# EAGLE design NMX-200 (EAGLE 7.6.0)
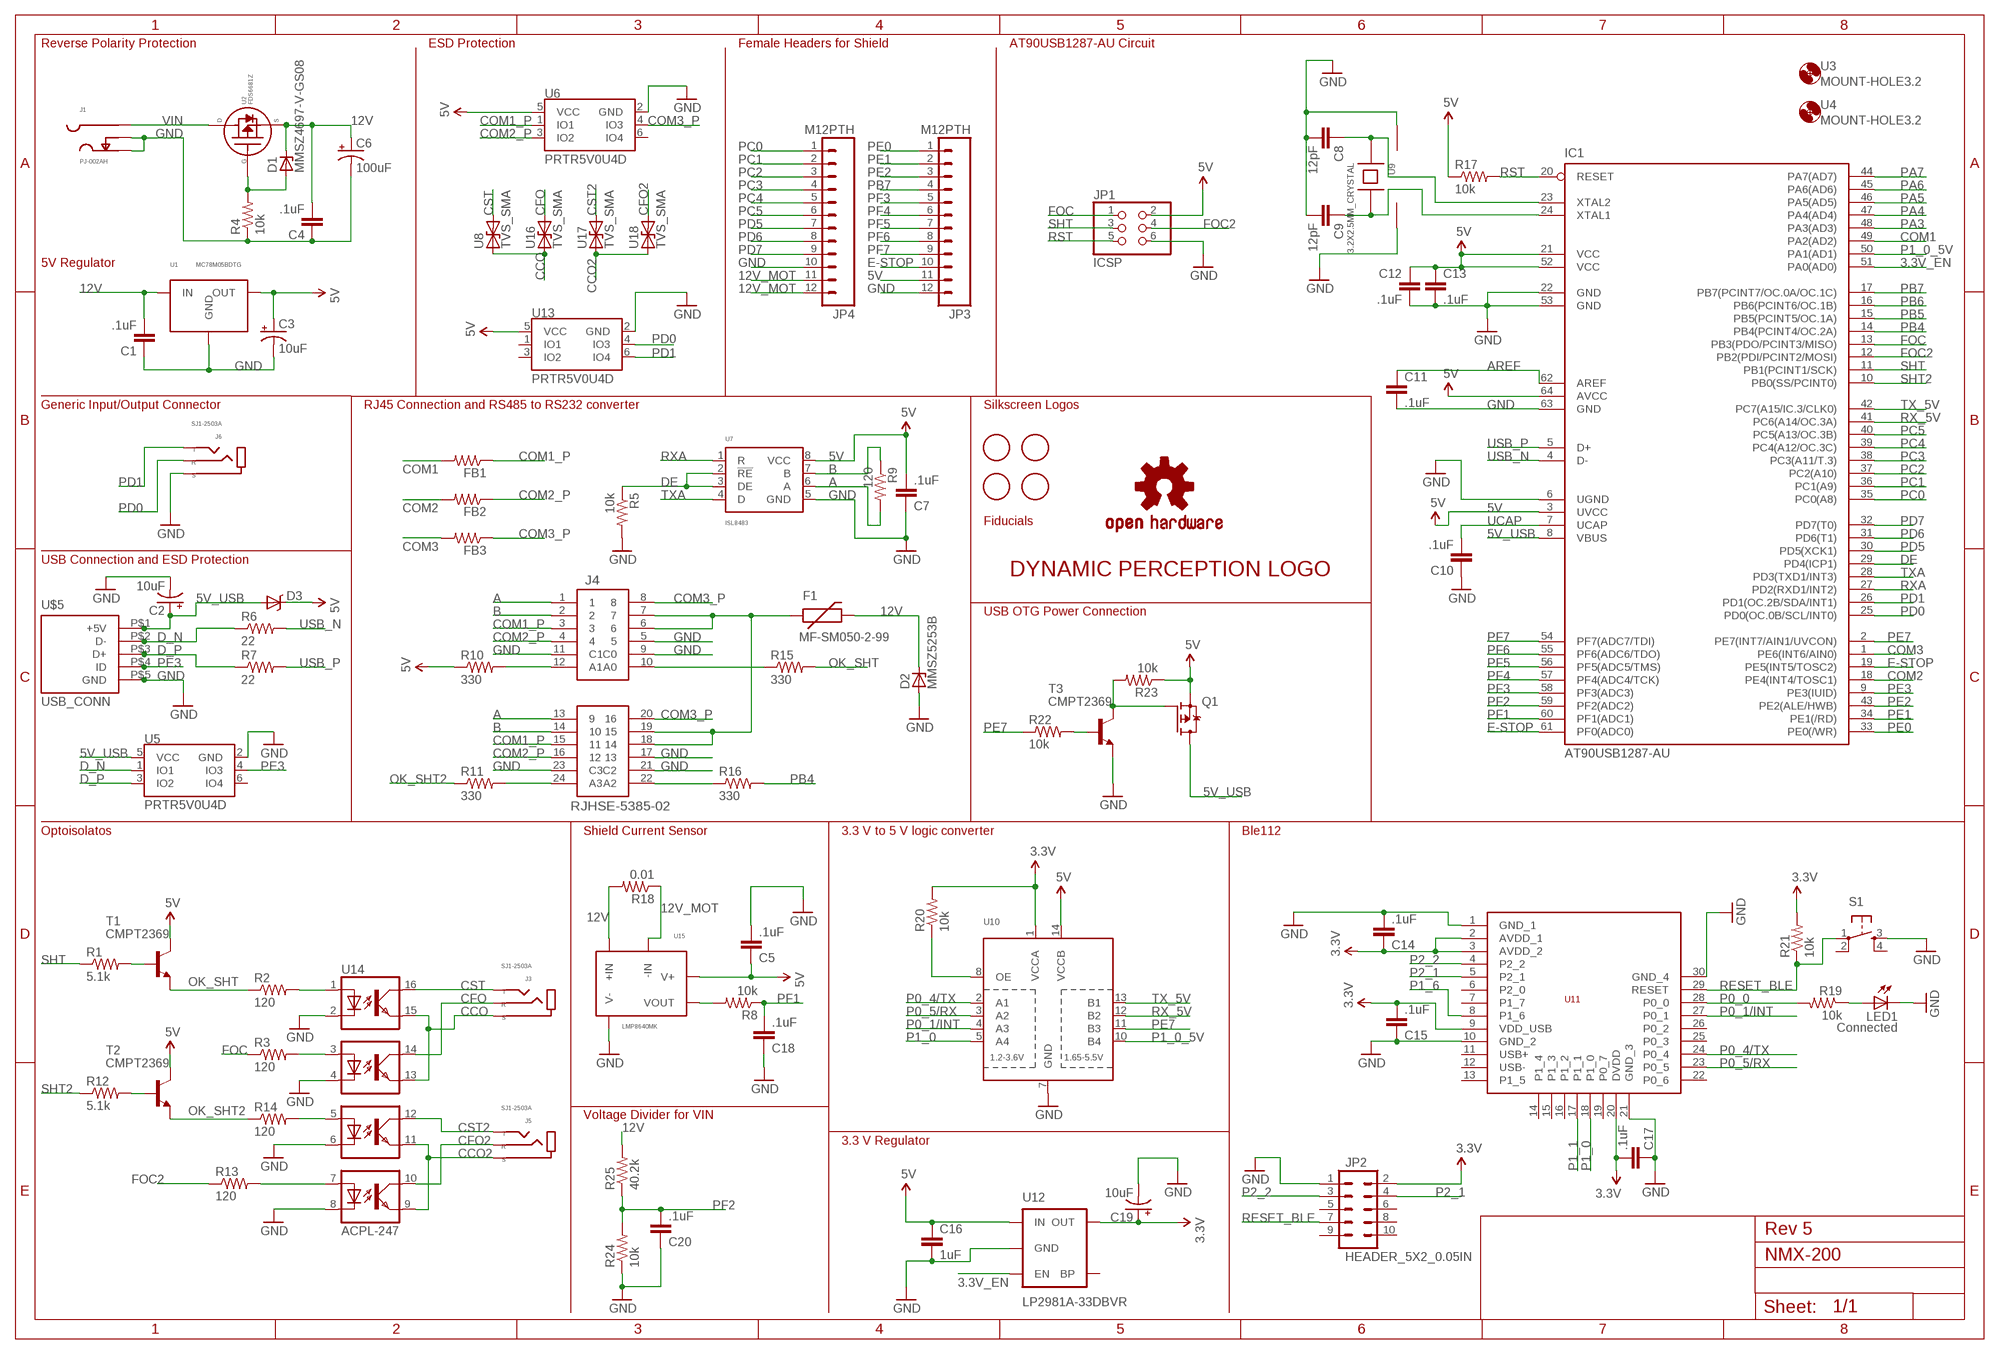
[diagram p0: schematic, sheet 1]

## Parts
C1  .1uF  CAP0402-CAP  [0402-CAP]
C2  10uF  CAP_POL1206  [EIA3216]
C3  10uF  CAP_POL1206  [EIA3216]
C4  .1uF  CAP0402-CAP  [0402-CAP]
C5  .1uF  CAP0402-CAP  [0402-CAP]
C6  100uF  CAP_POLD  [PANASONIC_D]
C7  .1uF  CAP0402-CAP  [0402-CAP]
C8  12pF  CAP0402-CAP  [0402-CAP]
C9  12pF  CAP0402-CAP  [0402-CAP]
C10  .1uF  CAP0402-CAP  [0402-CAP]
C11  .1uF  CAP0402-CAP  [0402-CAP]
C12  .1uF  CAP0402-CAP  [0402-CAP]
C13  .1uF  CAP0402-CAP  [0402-CAP]
C14  .1uF  CAP0402-CAP  [0402-CAP]
C15  .1uF  CAP0402-CAP  [0402-CAP]
C16  1uF  CAP0402-CAP  [0402-CAP]
C17  .1uF  CAP0402-CAP  [0402-CAP]
C18  .1uF  CAP0402-CAP  [0402-CAP]
C19  10uF  CAP_POL1206  [EIA3216]
C20  .1uF  CAP0402-CAP  [0402-CAP]
D1  MMSZ4697-V-GS08  ZENER-DIODESOD123  [SOD123]
D2  MMSZ5253B  ZENER-DIODESOD123  [SOD123]
D3  DIODE-SCHOTTKY-BAT20J  [SOD-323]
F1  MF-SM050-2-99  PTC2920  [PTC-2920]
FB1  HZ0402B102R-10  R-US_R0402  [R0402]
FB2  HZ0402B102R-10  R-US_R0402  [R0402]
FB3  HZ0402B102R-10  R-US_R0402  [R0402]
FRAME2  A3L-LOCSILK_SCREEN  [DRAWING_NAME]
IC1  AT90USB1287-AU  [TQFP64]
J1  PJ-002AH  DC_JACK  [DC_JACK_KLDX]
J3  SJ1-2503A  TRS_JACKSJ1-2503A  [SJ1-2503A]
J4  RJHSE-5385-02  RJ45_DOUBLEPTH  [RJHSE-5385-02]
J5  SJ1-2503A  TRS_JACKSJ1-2503A  [SJ1-2503A]
J6  SJ1-2503A  TRS_JACKSJ1-2503A  [SJ1-2503A]
JP1  ICSP  PINHD-2X3  [2X03]
JP2  HEADER_5X2_0.05IN  [HEADER_5X2_0.05IN]
JP3  M12PTH  [1X12]
JP4  M12PTH  [1X12]
LED1  Connected  LED0603  [LED-0603]
Q1  P-CHANNEL_MOSFET  [SOT23-3]
R1  5.1k  R-US_R0402  [R0402]
R2  120  R-US_R0402  [R0402]
R3  120  R-US_R0402  [R0402]
R4  10k  R-US_R0402  [R0402]
R5  10k  R-US_R0402  [R0402]
R6  22  R-US_R0402  [R0402]
R7  22  R-US_R0402  [R0402]
R8  10k  R-US_R0402  [R0402]
R9  120  R-US_R0402  [R0402]
R10  330  R-US_R0402  [R0402]
R11  330  R-US_R0402  [R0402]
R12  5.1k  R-US_R0402  [R0402]
R13  120  R-US_R0402  [R0402]
R14  120  R-US_R0402  [R0402]
R15  330  R-US_R0402  [R0402]
R16  330  R-US_R0402  [R0402]
R17  10k  R-US_R0402  [R0402]
R18  0.01  R-US_R1206  [R1206]
R19  10k  R-US_R0402  [R0402]
R20  10k  R-US_R0402  [R0402]
R21  10k  R-US_R0402  [R0402]
R22  10k  R-US_R0402  [R0402]
R23  10k  R-US_R0402  [R0402]
R24  10k  R-US_R0402  [R0402]
R25  40.2k  R-US_R0402  [R0402]
S1  TAC_SWITCH  [TACTICLE_SWITCH_SMD_EVQP0_BOT]
T1  CMPT2369  BCW60-NPN-SOT23-BEC  [SOT23-BEC]
T2  CMPT2369  BCW60-NPN-SOT23-BEC  [SOT23-BEC]
T3  CMPT2369  BCW60-NPN-SOT23-BEC  [SOT23-BEC]
U1  MC78M05BDTG  VOLTAGE_REG  [DPAK-3]
U2  FDS6681Z  MOSFET_P-CHANNEL  [DSO-8]
U3  MOUNT-HOLE3.2  [3,2]
U4  MOUNT-HOLE3.2  [3,2]
U5  PRTR5V0U4D  [SOT23-6]
U6  PRTR5V0U4D  [SOT23-6]
U7  ISL8483  SN65176D  [SO-08]
U8  TVS_SMA  [SMA_DIODE]
U9  3.2X2.5MM_CRYSTAL  [3.2X2.5MM]
U10  TXB0104PWR  [TSSOP14]
U11  BLE112  [BLE112-A]
U12  LP2981A-33DBVR  V_REG_LDOSMD  [SOT23-5]
U13  PRTR5V0U4D  [SOT23-6]
U14  ACPL-247  [16-SOIC]
U15  LMP8640MK  [6-SOT]
U16  TVS_SMA  [SMA_DIODE]
U17  TVS_SMA  [SMA_DIODE]
U18  TVS_SMA  [SMA_DIODE]
U$1  DP_LOGOMICRO  [DP_LOGO_MICRO]
U$2  OSHW-LOGOS  [OSHW-LOGO-S]
U$3  FIDUCIAL  [FIDUCIAL_1MM]
U$4  FIDUCIAL  [FIDUCIAL_1MM]
U$5  USB_CONN  [10118194-0001LF]
U$6  FIDUCIAL  [FIDUCIAL_1MM]
U$7  FIDUCIAL  [FIDUCIAL_1MM]

## Nets
3.3V: C14.1 C15.2 C17.2 C19.A(+) JP2.2 R20.2 R21.2 U10.1(VCCA) U11.2(AVDD_1) U11.3(AVDD_2) U11.9(VDD_USB) U11.20(DVDD) U12.5(OUT)
3.3V_EN: IC1.51(PA0(AD0)) U12.3(EN)
5V [vccControllers]: C3.A(+) C5.1 C7.2 C12.1 C13.1 C16.1 D3.C IC1.3(UVCC) IC1.21(VCC) IC1.52(VCC) IC1.64(AVCC) JP1.2 JP3.11 Q1.S R10.1 R17.1 R23.1 T1.C T2.C U1.2(OUT) U6.5(VCC) U7.8(VCC) U10.14(VCCB) U12.1(IN) U13.5(VCC) U15.6(V+)
5V_USB [vccControllers]: C2.A(+) D3.A IC1.8(VBUS) Q1.D U5.5(VCC) U$5.P$1(+5V)
12V [vccControllers]: C1.2 C4.2 C6.+ D1.C D2.C F1.P$2 R18.2 R25.2 U1.1(IN) U2.1(SOURCE) U2.2(SOURCE) U2.3(SOURCE) U15.3(+IN)
12V_MOT [vccControllers]: JP4.11 JP4.12 R18.1 U15.4(-IN)
A: J4.1 J4.13 R9.2 U7.6(A)
AREF: C11.1 IC1.62(AREF)
B: J4.2 J4.14 R9.1 U7.7(B)
CCO: J3.1(S) U8.C U14.13 U14.15 U16.C
CCO2: J5.1(S) U14.9 U14.11 U17.C U18.C
CFO: J3.4(R) U14.14 U16.A
CFO2: J5.4(R) U14.10 U18.A
COM1: FB1.2 IC1.49(PA2(AD2))
COM1_P: FB1.1 J4.3 J4.15 U6.1(IO1)
COM2: FB2.2 IC1.18(PE4(INT4/TOSC1))
COM2_P: FB2.1 J4.4 J4.16 U6.3(IO2)
COM3: FB3.2 IC1.1(PE6(INT6/AIN0))
COM3_P: FB3.1 J4.8 J4.20 U6.4(IO3)
CST: J3.2(T) J3.3(T) U8.A U14.16
CST2: J5.2(T) J5.3(T) U14.12 U17.A
D_N: R6.1 U5.1(IO1) U$5.P$2(D-)
D_P: R7.1 U5.3(IO2) U$5.P$3(D+)
DE: IC1.29(PD4(ICP1)) R5.1 U7.2(!RE) U7.3(DE)
E-STOP: IC1.19(PE5(INT5/TOSC2)) IC1.61(PF0(ADC0)) JP3.10
FOC: IC1.13(PB3(PDO/PCINT3/MISO)) JP1.1 R3.1
FOC2: IC1.12(PB2(PDI/PCINT2/MOSI)) JP1.4 R13.1
GND [gnd]: C1.1 C2.C(-) C3.C(-) C4.1 C5.2 C6.- C7.1 C8.2 C9.2 C10.1 C11.2 C12.2 C13.2 C14.2 C15.1 C16.2 C17.1 C18.1 C19.C(-) C20.1 D2.A IC1.6(UGND) IC1.22(GND) IC1.53(GND) IC1.63(GND) J1.GND(SLEEVE) J1.GNDBREAK(SLEEVE_SHUNT) J4.5 J4.9(C0) J4.11(C1) J4.17 J4.21(C2) J4.23(C3) J6.1(S) JP1.6 JP2.1 JP3.12 JP4.10 LED1.C R4.1 R5.2 R24.1 S1.3 T3.E U1.4(GND) U5.2(GND) U6.2(GND) U7.5(GND) U9.2(GND) U9.4 U10.7(GND) U11.1(GND_1) U11.10(GND_2) U11.21(GND_3) U11.30(GND_4) U12.2(GND) U13.2(GND) U14.2 U14.4 U14.6 U14.8 U15.2(V-) U$5.P$5(GND)
N$1: R20.1 U10.8(OE)
N$2: R22.2 T3.B
N$3: LED1.A R19.1
N$4: J4.10(A0) R15.1
N$5: D1.A R4.2 U2.4(GATE)
N$6: R2.2 U14.1
N$7: R3.2 U14.3
N$8: R8.2 U15.1(VOUT)
N$9: R14.2 U14.5
N$10: R13.2 U14.7
N$11: J4.12(A1) R10.2
N$12: J4.24(A3) R11.2
N$13: Q1.G R23.2 T3.C
N$14: J4.22(A2) R16.1
N$15 [vcc]: F1.P$1 J4.6 J4.7 J4.18 J4.19
N$17: R1.2 T1.B
N$67: R12.2 T2.B
OK_SHT: R2.1 R15.2 T1.E
OK_SHT2: R11.1 R14.1 T2.E
P0_0: R19.2 U11.28(P0_0)
P0_1/INT: U10.4(A3) U11.27(P0_1)
P0_4/TX: U10.2(A1) U11.24(P0_4)
P0_5/RX: U10.3(A2) U11.23(P0_5)
P1_0: U10.5(A4) U11.18(P1_0)
P1_0_5V: IC1.50(PA1(AD1)) U10.10(B4)
P1_1: U11.17(P1_1)
P1_6: U11.8(P1_6)
P2_1: JP2.4 U11.5(P2_1)
P2_2: JP2.3 U11.4(P2_2)
PA3: IC1.48(PA3(AD3))
PA4: IC1.47(PA4(AD4))
PA5: IC1.46(PA5(AD5))
PA6: IC1.45(PA6(AD6))
PA7: IC1.44(PA7(AD7))
PB4: IC1.14(PB4(PCINT4/OC.2A)) R16.2
PB5: IC1.15(PB5(PCINT5/OC.1A))
PB6: IC1.16(PB6(PCINT6/OC.1B))
PB7: IC1.17(PB7(PCINT7/OC.0A/OC.1C)) JP3.4
PC0: IC1.35(PC0(A8)) JP4.1
PC1: IC1.36(PC1(A9)) JP4.2
PC2: IC1.37(PC2(A10)) JP4.3
PC3: IC1.38(PC3(A11/T.3)) JP4.4
PC4: IC1.39(PC4(A12/OC.3C)) JP4.5
PC5: IC1.40(PC5(A13/OC.3B)) JP4.6
PD0: IC1.25(PD0(OC.0B/SCL/INT0)) J6.4(R) U13.4(IO3)
PD1: IC1.26(PD1(OC.2B/SDA/INT1)) J6.2(T) J6.3(T) U13.6(IO4)
PD5: IC1.30(PD5(XCK1)) JP4.7
PD6: IC1.31(PD6(T1)) JP4.8
PD7: IC1.32(PD7(T0)) JP4.9
PE0: IC1.33(PE0(/WR)) JP3.1
PE1: IC1.34(PE1(/RD)) JP3.2
PE2: IC1.43(PE2(ALE/HWB)) JP3.3
PE3: IC1.9(PE3(IUID)) U5.4(IO3) U$5.P$4(ID)
PE7: IC1.2(PE7(INT7/AIN1/UVCON)) R22.1 U10.11(B3)
PF1: C18.2 IC1.60(PF1(ADC1)) R8.1
PF2: C20.2 IC1.59(PF2(ADC2)) R24.2 R25.1
PF3: IC1.58(PF3(ADC3)) JP3.5
PF4: IC1.57(PF4(ADC4/TCK)) JP3.6
PF5: IC1.56(PF5(ADC5/TMS)) JP3.7
PF6: IC1.55(PF6(ADC6/TDO)) JP3.8
PF7: IC1.54(PF7(ADC7/TDI)) JP3.9
RESET_BLE: JP2.7 R21.1 S1.1 U11.29(RESET)
RST: IC1.20(RESET) JP1.5 R17.2
RX_5V: IC1.41(PC6(A14/OC.3A)) U10.12(B2)
RXA: IC1.27(PD2(RXD1/INT2)) U7.1(R)
SHT: IC1.11(PB1(PCINT1/SCK)) JP1.3 R1.1
SHT2: IC1.10(PB0(SS/PCINT0)) R12.1
TX_5V: IC1.42(PC7(A15/IC.3/CLK0)) U10.13(B1)
TXA: IC1.28(PD3(TXD1/INT3)) U7.4(D)
UCAP: C10.2 IC1.7(UCAP)
USB_N: IC1.4(D-) R6.2
USB_P: IC1.5(D+) R7.2
VIN [PowerInput]: J1.PWR(PIN) U2.5(DRAIN) U2.6(DRAIN) U2.7(DRAIN) U2.8(DRAIN)
XTAL1: C9.1 IC1.24(XTAL1) U9.3
XTAL2: C8.1 IC1.23(XTAL2) U9.1
Unconnected: JP2.5 JP2.6 JP2.8 JP2.9 JP2.10 S1.2 S1.4 U5.6(IO4) U6.6(IO4) U11.6(P2_0) U11.7(P1_7) U11.11(USB+) U11.12(USB-) U11.13(P1_5) U11.14(P1_4) U11.15(P1_3) U11.16(P1_2) U11.19(P0_7) U11.22(P0_6) U11.25(P0_3) U11.26(P0_2) U12.4(BP) U13.1(IO1) U13.3(IO2)

## Notes on the sheet
- Reverse Polarity Protection | ESD Protection | Female Headers for Shield | AT90USB1287-AU Circuit
- 5V Regulator
- Generic Input/Output Connector | RJ45 Connection and RS485 to RS232 converter | Silkscreen Logos
- Fiducials
- USB Connection and ESD Protection
- USB OTG Power Connection
- Optoisolatos | Shield Current Sensor | 3.3 V to 5 V logic converter | Ble112
- Voltage Divider for VIN
- 3.3 V Regulator
- Rev 5

## Library data of the parts
C1 C4 C5 C7 C10-C15 C17 C18 C20 = SparkFun-Capacitors:CAP: Capacitor Standard 0603 ceramic capacitor, and 0.1" leaded capacitor.; MF: Taiyo Yuden; MPN: TMK105BJ104KV-F
C2 C3 C19 = SparkFun-Capacitors:CAP_POL: Capacitor Polarized These are standard SMD and PTH capacitors. Normally 10uF, 47uF, and 100uF in electrolytic and tantalum varieties. Always verify the external diameter of the through hole cap, it varies with capacity, voltage, and manufacturer. The EIA devices should be standard.; MF: Kemet; MPN: T491A106M016AT
C6 = SparkFun-Capacitors:CAP_POL: Capacitor Polarized These are standard SMD and PTH capacitors. Normally 10uF, 47uF, and 100uF in electrolytic and tantalum varieties. Always verify the external diameter of the through hole cap, it varies with capacity, voltage, and manufacturer. The EIA devices should be standard.; MF: Panasonic Electronic Components; MPN: EEE-1EA101XP
C8 C9 = SparkFun-Capacitors:CAP: Capacitor Standard 0603 ceramic capacitor, and 0.1" leaded capacitor.; MF: TDK Corporation; MPN: C1005C0G1H120J050BA
C16 = SparkFun-Capacitors:CAP: Capacitor Standard 0603 ceramic capacitor, and 0.1" leaded capacitor.; MF: TDK Corporation; MPN: C1005X5R1C105K050BC
D1 = diode:ZENER-DIODE: Z-Diode; MF: Vishay Semiconductor Diodes Division; MPN: MMSZ4697-E3-08
D2 = diode:ZENER-DIODE: Z-Diode; MF: Fairchild Semiconductor; MPN: MMSZ5253B
D3 = SparkFun-DiscreteSemi:DIODE-SCHOTTKY: Schottky diodes in SFE's production catalog BAT20J 1A 23V 0.62Vf RB751 120mA 40V 0.37Vf PMEG4005EJ 0.5A 40V 0.42Vf MBRA140 1A 40V 0.5Vf B340A 3A 40V SMA; MF: NXP Semiconductors; MPN: PMEG3010BEA,115; PROD_ID: DIO-11623; VALUE: BAT20J
F1 = SparkFun-PowerIC:PTC: Resettable Fuse PTC Resettable Fuse. Spark Fun Electronics SKU : COM-08357; MF: Bel Fuse; MPN: 0ZCD0050FF2C
FB1-FB3 = resistor:R-US_: RESISTOR, American symbol; MF: Laird-Signal Integrity Products; MPN: HZ0402B102R-10
FRAME2 = frames:A3L-LOC: FRAME DIN A3, landscape with location and doc. field
IC1 = at90usb:AT90USB1287-*: Atmel AT90USB1287 AVR Microcontroller with USB Interface and 128kB Flash Memory; MF: Atmel; MPN: AT90USB1287-AU
J1 = QS_Components:DC_JACK; MF: CUI Inc; MPN: PJ-002AH
J3 J5 J6 = PP_Connectors:TRS_JACK: TRS Jacks; MF: CUI Inc; MPN: SJ1-2503A
J4 = PP_Connectors:RJ45_DOUBLE: RJ45 Connectors - Double; MF: Amphenol Commercial Products; MPN: RJHSE-5385-02
JP1 = pinhead:PINHD-2X3: PIN HEADER; MF: FCI; MPN: 67996-406HLF
JP2 = QS_Components:HEADER_5X2_0.05IN; MF: FCI; MPN: 20021121-00010T4LF
JP3 JP4 = SparkFun-Connectors:M12: Header 12 Standard 12-pin 0.1" header. Use with straight break away headers (SKU : PRT-00116), right angle break away headers (PRT-00553), swiss pins (PRT-00743), machine pins (PRT-00117), and female headers (PRT-00115).; MF: Sullins Connector Solutions; MPN: PPTC121LFBN-RC
LED1 = SparkFun-LED:LED: LEDs Standard schematic elements and footprints for 5mm, 3mm, 1206, and 0603 sized LEDs. 5mm - Spark Fun Electronics SKU : COM-00529 (and others); MF: Lite-On Inc; MPN: LTST-S270TBKT
Q1 = QS_Components:P-CHANNEL_MOSFET; MF: Fairchild Semiconductor; MPN: FDV304P
R1 R12 = resistor:R-US_: RESISTOR, American symbol; MF: Yageo; MPN: RC0402JR-075K1L
R2 R3 R13 R14 = resistor:R-US_: RESISTOR, American symbol; MF: Yageo; MPN: RC0402FR-07180RL
R4 R5 R8 R17 R20-R24 = resistor:R-US_: RESISTOR, American symbol; MF: Yageo; MPN: RC0402FR-0710KL
R6 R7 = resistor:R-US_: RESISTOR, American symbol; MF: Yageo; MPN: RC0402JR-0722RL
R9 = resistor:R-US_: RESISTOR, American symbol; MF: Yageo; MPN: RC0402JR-07120RL
R10 R11 R15 R16 = resistor:R-US_: RESISTOR, American symbol; MF: Yageo; MPN: RC0402FR-07330RL
R18 = resistor:R-US_: RESISTOR, American symbol; MF: TE Connectivity; MPN: RLP73V2BR010JTD
R19 = resistor:R-US_: RESISTOR, American symbol; MF: Yageo; MPN: RC0402FR-0714KL
R25 = resistor:R-US_: RESISTOR, American symbol; MF: Yageo; MPN: RC0402FR-0740K2L
S1 = SparkFun-Electromechanical:TAC_SWITCH: Momentary Switch Button commonly used for reset or general input. Spark Fun Electronics SKU : COM-00097 SMT- SWCH-08247; MF: Panasonic Electronic Components; MPN: EVQ-P0Q02Q
T1 T2 = transistor:*-NPN-: NPN Transistror BF959 corrected 2008.03.06; MF: Rohm Semiconductor; MPN: 2SD1757KT146Q
T3 = transistor:*-NPN-: NPN Transistror BF959 corrected 2008.03.06; MF: Fairchild Semiconductor; MPN: BC847BMTF
U1 = QS_Components:VOLTAGE_REG; MF: ON Semiconductor; MPN: MC78M05BDTRKG
U2 = QS_Components:MOSFET_P-CHANNEL; MF: Fairchild Semiconductor; MPN: FDS6681Z
U3 U4 = holes:MOUNT-HOLE: MOUNTING HOLE with drill center marker
U5 U6 U13 = QS_Components:PRTR5V0U4D; MF: NXP Semiconductors; MPN: PRTR5V0U4D
U7 = texas:SN65176: DIFFERENTIAL BUS TRANSCEIVER Source: http://focus.ti.com .. sn65176b.pdf; MF: TEXAS INSTRUMENTS; MPN: SN65176BD; OC_FARNELL: 9589970; OC_NEWARK: 08F5891
U8 U16-U18 = QS_Components:TVS_SMA; MF: Bourns Inc; MPN: SMAJ48CA
U9 = QS_Components:3.2X2.5MM_CRYSTAL; MF: AVX Corp/Kyocera Corp; MPN: CX3225SB16000E0FPZ25
U10 = SparkFun-DigitalIC:TXB0104PWR: 4-Bit Bi-Directional Level Shifter 1.2V-3.6V (VCCA) to 1.65V-5.5V (VCCB) bi-directional level shifter with auto direction sensing. Max data rate - VCCA 1.8V: 20Mbps (50ns), VCCA 3.3V: 100Mbps (10ns) Digikey: 296-21929-1-ND (TSSOP) IC-11329; MF: Texas Instruments; MPN: TXB0104PWR
U11 = Bluegiga:BLE112: Bluetooth low energy single mode module is a single mode device targeted for low power sensors and accessories.; MF: BlueGiga Technologies Inc; MPN: BLE112-A-V1
U12 = SparkFun-PowerIC:V_REG_LDO: Voltage Regulator LDO Standard 150mA LDO voltage regulator in SOT-23 layout. Micrel part MIC5205. BP (by-pass) pin is used to lower output noise with 470pF cap.; MF: Texas Instruments; MPN: LP2981A-33DBVR
U14 = QS_Components:ACPL-247; MF: Avago Technologies US Inc.; MPN: ACPL-247-500E
U15 = QS_Components:LMP8640MK; MF: Texas Instruments; MPN: LMP8640MK-H/NOPB
U$1 = QS_Components:DP_LOGO
U$2 = SparkFun-Aesthetics:OSHW-LOGO: Open Source Hardware Logo This logo indicates the piece of hardware it is found on incorporates a OSHW license and/or adheres to the definition of open source hardware found here: http://freedomdefined.org/OSHW
U$3 U$4 U$6 U$7 = adafruit:FIDUCIAL: For use by pick and place machines to calibrate the vision/machine, 1mm By microbuilder.eu
U$5 = dynamic_perception:USB_CONN

## Net classes
0 default: width 0.203 mm, drill 0.254 mm, clearance 0.152 mm
1 vcc: width 0.61 mm, drill 0.254 mm, clearance 0.152 mm
2 gnd: width 0.305 mm, drill 0.254 mm, clearance 0.152 mm
3 vccControllers: width 0.305 mm, drill 0.254 mm, clearance 0.152 mm
4 StepperPower: width 0.635 mm, drill 0.254 mm, clearance 0.152 mm
5 PowerInput: width 1.27 mm, clearance 0.152 mm

## Board
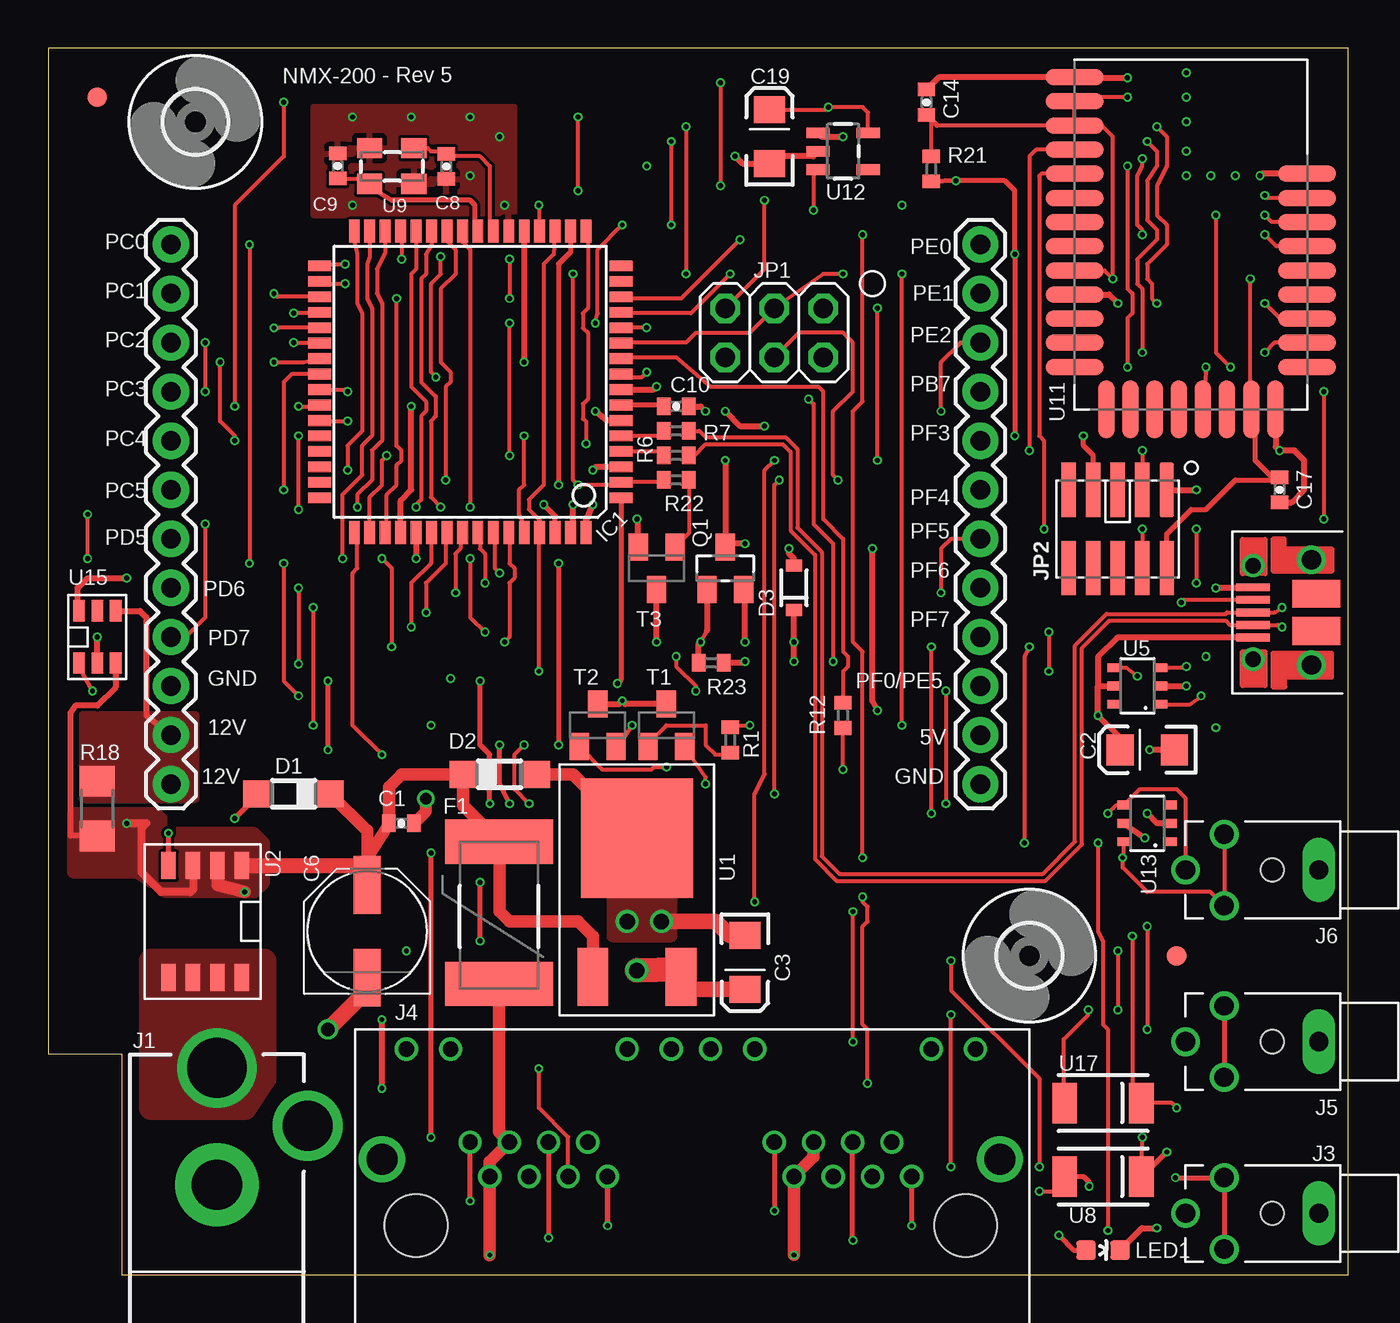
[diagram p1: board, top side]
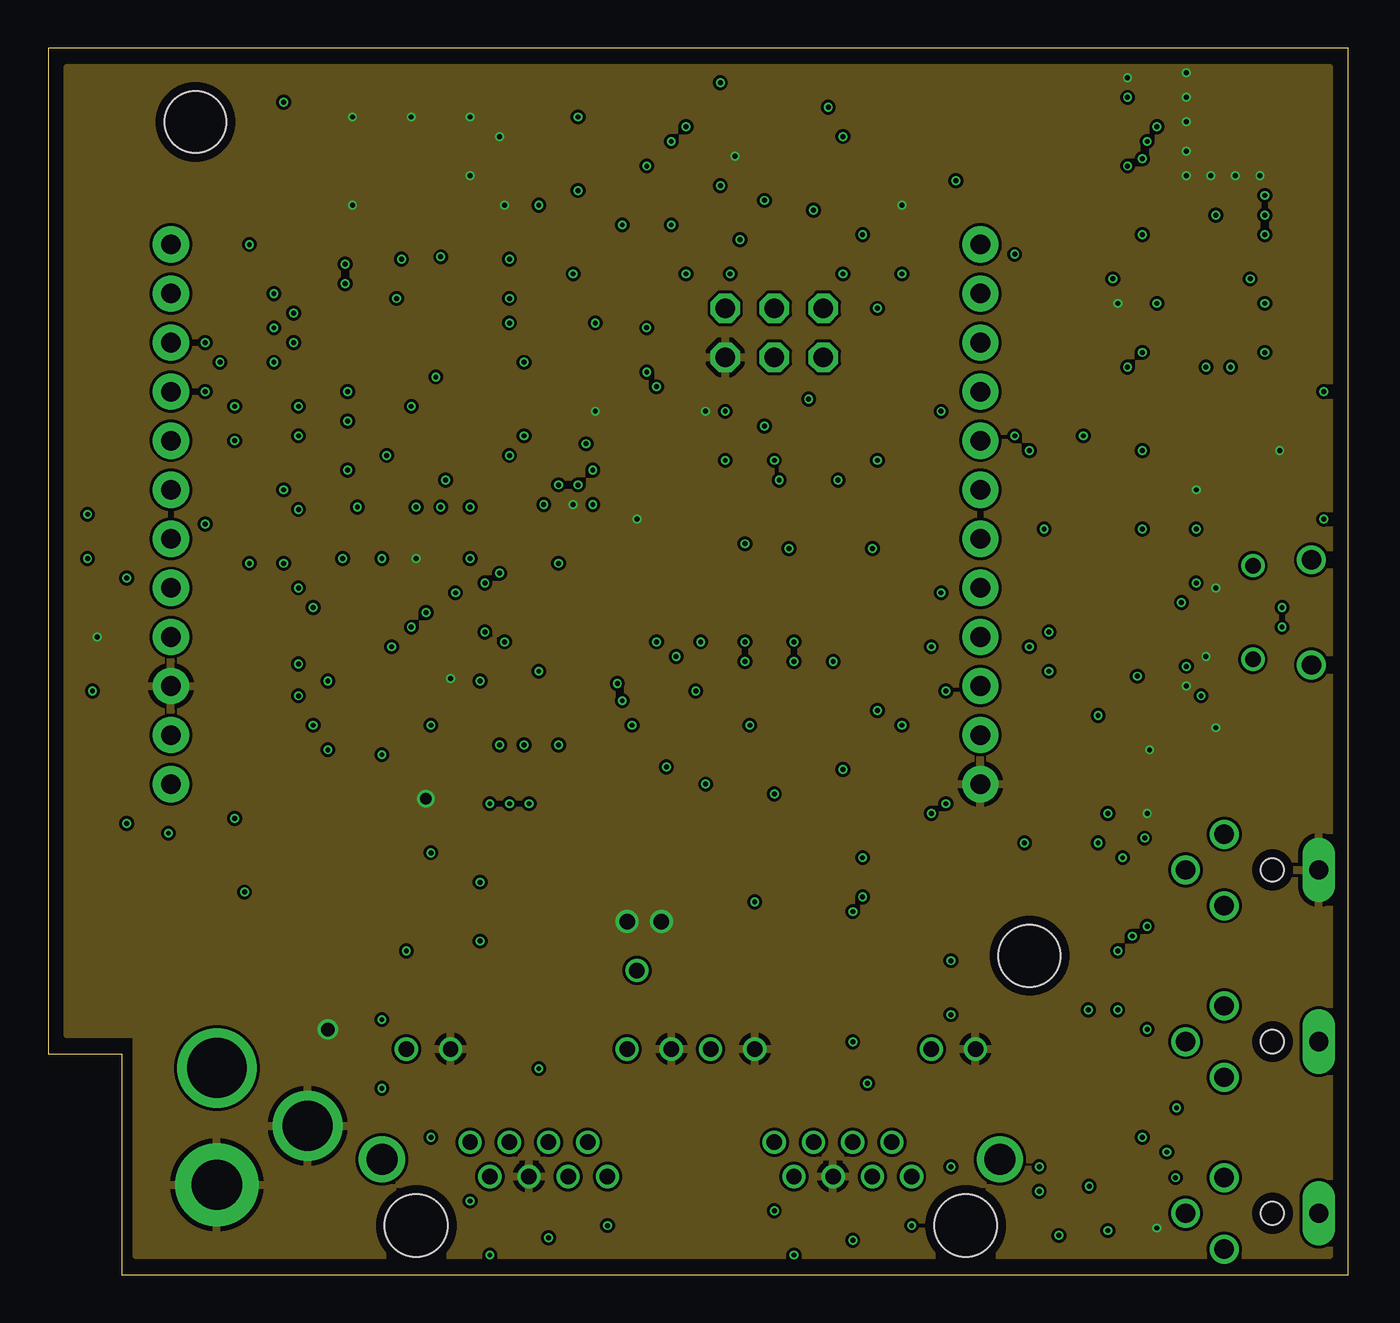
[diagram p2: board, inner layer Route2]
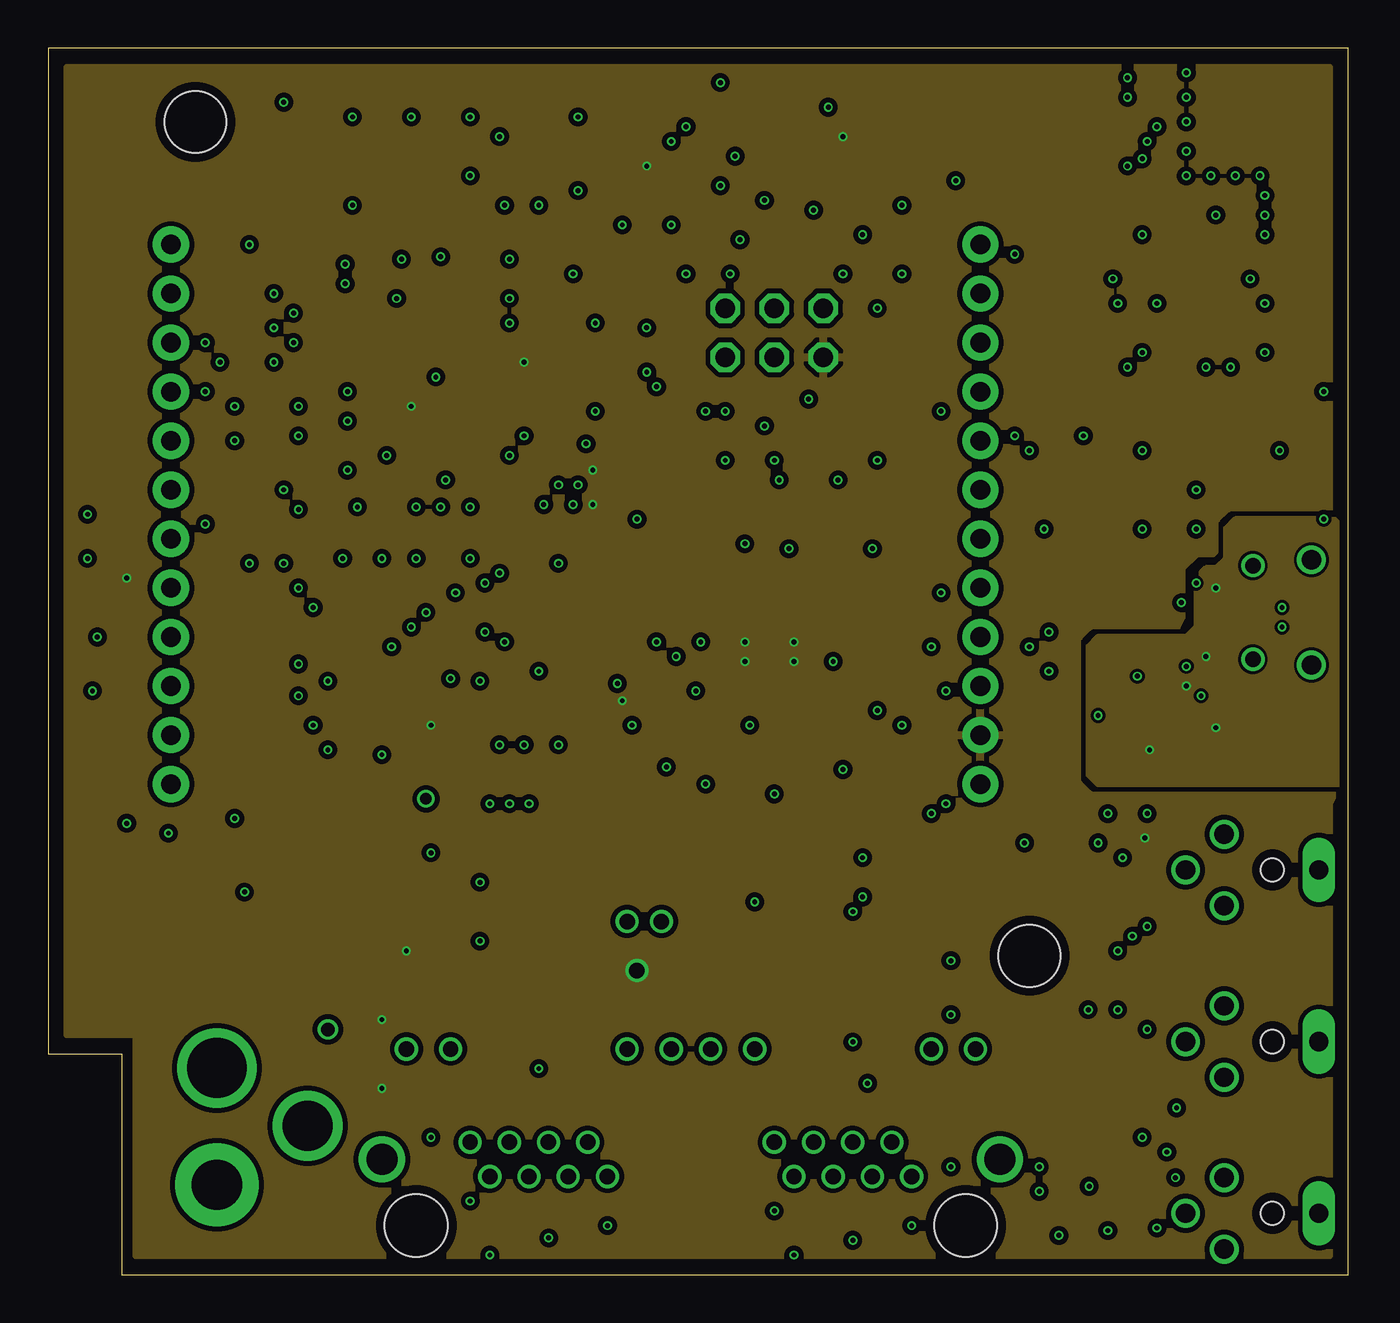
[diagram p3: board, inner layer Route15]
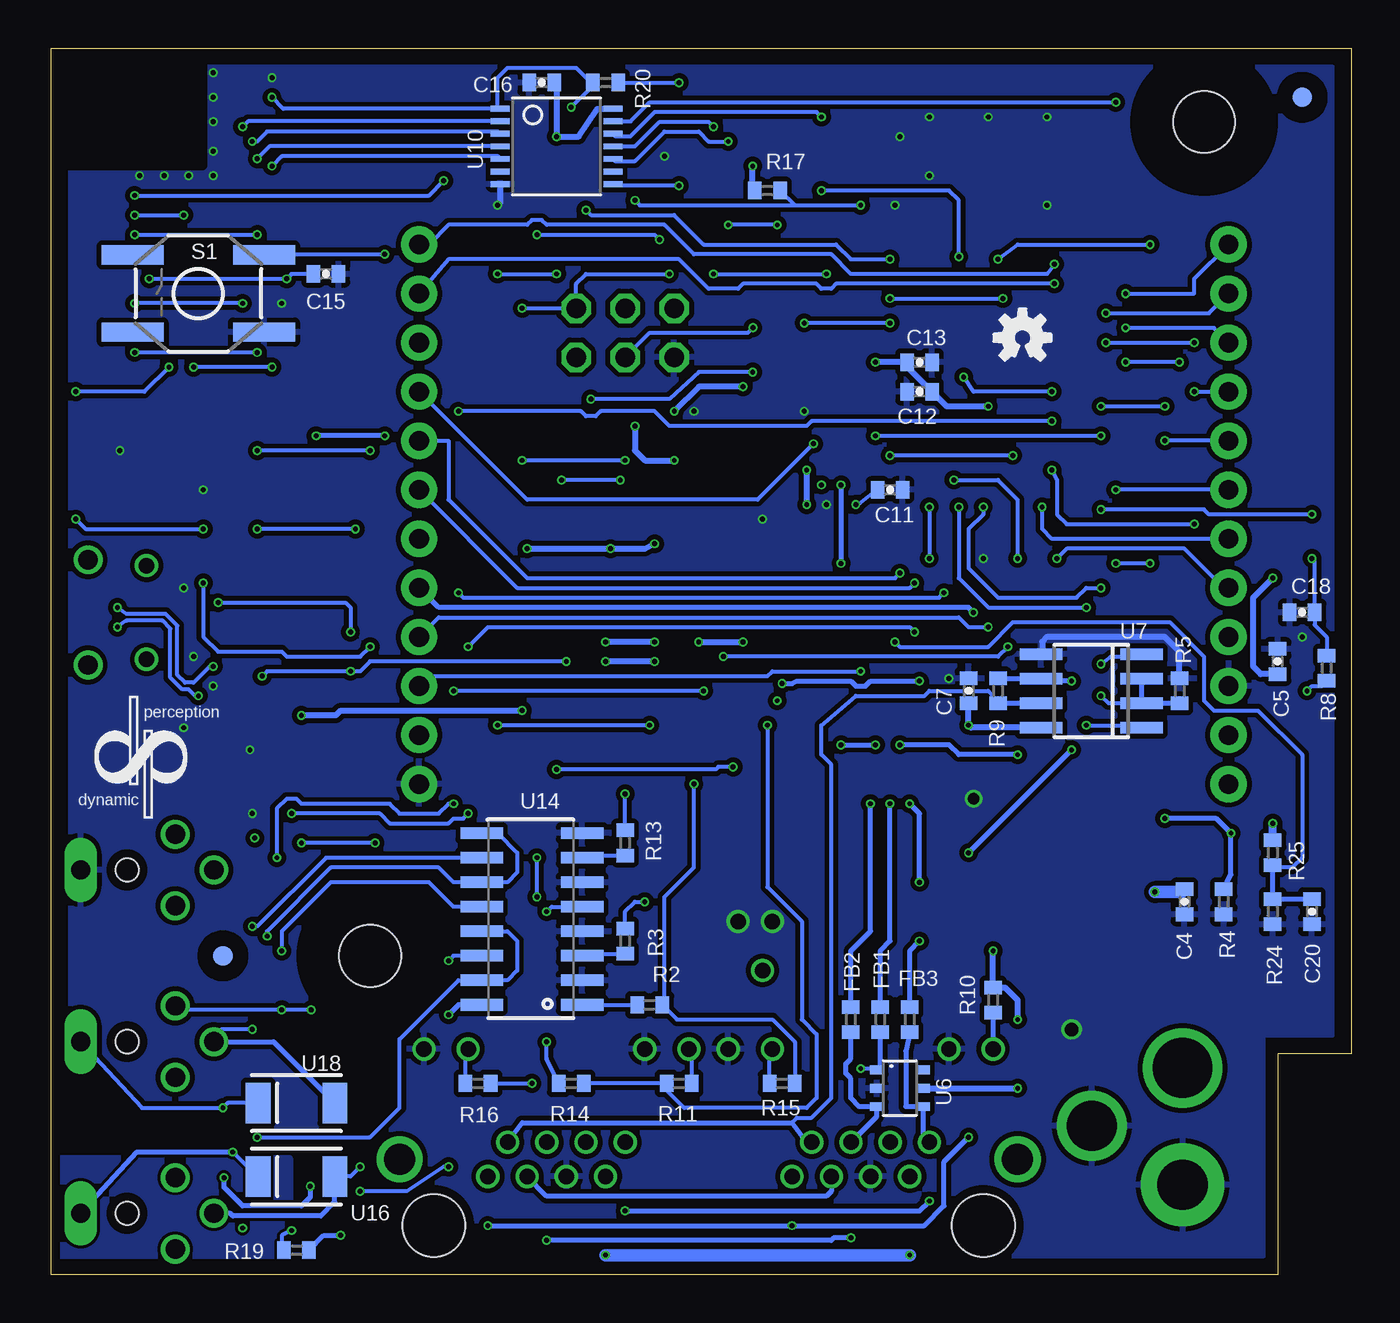
[diagram p4: board, bottom side, seen from below]

Size 67.31 x 63.5 mm. Coordinates in mm from the lower left corner, seen from the top.
Outline: 67.31,0 67.31,63.5 0,63.5 0,11.43 3.81,11.43 3.81,0 67.31,0
Copper layers (1*2*15*16): Top 0.035559375mm / dielectric 0.17018125mm / Route2 0.01778125mm / dielectric 47mil / Route15 0.01778125mm / dielectric 0.17018125mm / Bottom 0.035559375mm
Design rules "OSHPark-4layer *": minimum track width 5mil, minimum drill 10mil, track to track 5mil, track to pad 5mil, pad to pad 5mil, via to via 5mil, smd to smd 5mil, copper to edge 18mil, drill to drill 6mil, minimum pad ring 4mil, minimum via ring 4mil, stop-mask expansion 2.5mil, vias tented up to drill 11mil, thermal gap 10mil

### Footprints (pad centres in the part's own frame; a part is rotated, then mirrored left to right if it is on the bottom)
0402-CAP = smd 0.7 x 0.9: 1 -0.65,0; 2 0.65,0
EIA3216 = smd 1.4 x 1.6: A -1.4,0; C 1.4,0
PANASONIC_D = smd 3 x 1.4: + -2.4,0; - 2.4,0
SOD123 = smd 1.4 x 1.4: A 1.9,0; C -1.9,0
SOD-323 = smd 0.63 x 0.83: A 1.15,0; C -1.15,0
PTC-2920 = smd 2.286 x 5.588: P$1 -3.683,0; P$2 3.683,0
R0402 = smd 0.7 x 0.9: 1 -0.65,0; 2 0.65,0
TQFP64 = smd 1.194 x 0.559: 1 -7.8,6; 2 -7.8,5.2; 3 -7.8,4.4; 4 -7.8,3.6; 5 -7.8,2.8; 6 -7.8,2; 7 -7.8,1.2; 8 -7.8,0.4; 9 -7.8,-0.4; 10 -7.8,-1.2; 11 -7.8,-2; 12 -7.8,-2.8; 13 -7.8,-3.6; 14 -7.8,-4.4; 15 -7.8,-5.2; 16 -7.8,-6; 33 7.8,-6; 34 7.8,-5.2; 35 7.8,-4.4; 36 7.8,-3.6; 37 7.8,-2.8; 38 7.8,-2; 39 7.8,-1.2; 40 7.8,-0.4; 41 7.8,0.4; 42 7.8,1.2; 43 7.8,2; 44 7.8,2.8; 45 7.8,3.6; 46 7.8,4.4; 47 7.8,5.2; 48 7.8,6 | smd 0.559 x 1.194: 17 -6,-7.8; 18 -5.2,-7.8; 19 -4.4,-7.8; 20 -3.6,-7.8; 21 -2.8,-7.8; 22 -2,-7.8; 23 -1.2,-7.8; 24 -0.4,-7.8; 25 0.4,-7.8; 26 1.2,-7.8; 27 2,-7.8; 28 2.8,-7.8; 29 3.6,-7.8; 30 4.4,-7.8; 31 5.2,-7.8; 32 6,-7.8; 49 6,7.8; 50 5.2,7.8; 51 4.4,7.8; 52 3.6,7.8; 53 2.8,7.8; 54 2,7.8; 55 1.2,7.8; 56 0.4,7.8; 57 -0.4,7.8; 58 -1.2,7.8; 59 -2,7.8; 60 -2.8,7.8; 61 -3.6,7.8; 62 -4.4,7.8; 63 -5.2,7.8; 64 -6,7.8
DC_JACK_KLDX = drill 2.6 pad 4.318: GND 0,0.85 | drill 2.6: GNDBREAK 4.7,3.9 | drill 3.1: PWR 0,6.9
SJ1-2503A = drill 1 pad 1.676 long: 1 -2.54,0 | drill 1: 2 2.36,-1.85; 3 2.36,1.85; 4 4.36,0 | hole 1.2: -0.14,0
RJHSE-5385-02 = drill 0.8: 1 -4.07,1.27; 2 -5.09,3.05; 3 -6.1,1.27; 4 -7.12,3.05; 5 -8.13,1.27; 6 -9.15,3.05; 7 -10.16,1.27; 8 -11.18,3.05; 9 -0.76,7.87; 10 -3.05,7.87; 11 -12.19,7.87; 12 -14.48,7.87; 13 11.68,1.27; 14 10.66,3.05; 15 9.65,1.27; 16 8.63,3.05; 17 7.62,1.27; 18 6.6,3.05; 19 5.59,1.27; 20 4.57,3.05; 21 14.99,7.87; 22 12.7,7.87; 23 3.56,7.87; 24 1.27,7.87 | drill 1.6: P$1 -15.745,2.16; P$2 16.255,2.16 | hole 3.251: -13.97,-1.27; 14.48,-1.27
2X03 = drill 1.016 octagon: 1 -2.54,-1.27; 2 -2.54,1.27; 3 0,-1.27; 4 0,1.27; 5 2.54,-1.27; 6 2.54,1.27
HEADER_5X2_0.05IN = smd 2.8 x 0.74: 1 -2.03,2.54; 2 2.03,2.54; 3 -2.03,1.27; 4 2.03,1.27; 5 -2.03,0; 6 2.03,0; 7 -2.03,-1.27; 8 2.03,-1.27; 9 -2.03,-2.54; 10 2.03,-2.54
1X12 = drill 1.016 pad 1.88: 1 -13.97,0; 2 -11.43,0; 3 -8.89,0; 4 -6.35,0; 5 -3.81,0; 6 -1.27,0; 7 1.27,0; 8 3.81,0; 9 6.35,0; 10 8.89,0; 11 11.43,0; 12 13.97,0
LED-0603 = smd 1 x 1: A 0.877,0; C -0.877,0
SOT23-3 = smd 1.4 x 1: D 1.1,0; G -1.1,0.95; S -1.1,-0.95
R1206 = smd 1.6 x 1.803: 1 -1.422,0; 2 1.422,0
TACTICLE_SWITCH_SMD_EVQP0_BOT = smd 3.2 x 1 bottom: 1 -3.4,2; 2 3.4,2; 3 -3.4,-2; 4 3.4,-2
SOT23-BEC = smd 1 x 1.4: B -0.95,-1.1; C 0,1.1; E 0.95,-1.1
DPAK-3 = smd 3 x 1.6: 1 -4.39,2.285; 2 -4.39,-2.285 | smd 6.2 x 5.8: 4 2.79,0
DSO-8 = smd 1.4 x 0.75: 1 -2.9,1.905; 2 -2.9,0.635; 3 -2.9,-0.635; 4 -2.9,-1.905; 5 2.9,-1.905; 6 2.9,-0.635; 7 2.9,0.635; 8 2.9,1.905
3,2 = hole 3.2: 0,0
SOT23-6 = smd 0.7 x 0.45: 1 -1.2,0.95; 2 -1.2,0; 3 -1.2,-0.95; 4 1.2,-0.95; 5 1.2,0; 6 1.2,0.95
SO-08 = smd 2.2 x 0.6: 1 -2.6,1.905; 2 -2.6,0.635; 3 -2.6,-0.635; 4 -2.6,-1.905; 5 2.6,-1.905; 6 2.6,-0.635; 7 2.6,0.635; 8 2.6,1.905
SMA_DIODE = smd 1.27 x 2.1: A 1.985,0; C -1.985,0
3.2X2.5MM = smd 1.05 x 1.3: 1 -0.925,1.15; 2 -0.925,-1.15; 3 0.925,-1.15; 4 0.925,1.15
TSSOP14 = smd 0.991 x 0.305: 1 -2.918,1.95; 2 -2.918,1.3; 3 -2.918,0.65; 4 -2.918,0; 5 -2.918,-0.65; 6 -2.918,-1.3; 7 -2.918,-1.95; 8 2.918,-1.95; 9 2.918,-1.3; 10 2.918,-0.65; 11 2.918,0; 12 2.918,0.65; 13 2.918,1.3; 14 2.918,1.95
BLE112-A = smd 3 x 0.85: 1 -6.025,8.15; 2 -6.025,6.9; 3 -6.025,5.65; 4 -6.025,4.4; 5 -6.025,3.15; 6 -6.025,1.9; 7 -6.025,0.65; 8 -6.025,-0.6; 9 -6.025,-1.85; 10 -6.025,-3.1; 11 -6.025,-4.35; 12 -6.025,-5.6; 13 -6.025,-6.85; 22 6.025,-6.85; 23 6.025,-5.6; 24 6.025,-4.35; 25 6.025,-3.1; 26 6.025,-1.85; 27 6.025,-0.6; 28 6.025,0.65; 29 6.025,1.9; 30 6.025,3.15 | smd 0.85 x 3: 14 -4.375,-9.05; 15 -3.125,-9.05; 16 -1.875,-9.05; 17 -0.625,-9.05; 18 0.625,-9.05; 19 1.875,-9.05; 20 3.125,-9.05; 21 4.375,-9.05
SOT23-5 = smd 1.2 x 0.55: 1 -1.3,0.95; 2 -1.3,0; 3 -1.3,-0.95; 4 1.3,-0.95; 5 1.3,0.95
16-SOIC = smd 2.2 x 0.6: 1 -2.6,4.445; 2 -2.6,3.175; 3 -2.6,1.905; 4 -2.6,0.635; 5 -2.6,-0.635; 6 -2.6,-1.905; 7 -2.6,-3.175; 8 -2.6,-4.445; 9 2.6,-4.445; 10 2.6,-3.175; 11 2.6,-1.905; 12 2.6,-0.635; 13 2.6,0.635; 14 2.6,1.905; 15 2.6,3.175; 16 2.6,4.445
6-SOT = smd 1.1 x 0.6: 1 -1.35,0.95; 2 -1.35,0; 3 -1.35,-0.95; 4 1.35,-0.95; 5 1.35,0; 6 1.35,0.95
FIDUCIAL_1MM = smd 1 x 1: 1 0,0
10118194-0001LF = smd 0.4 x 1.75: P$1 -1.3,3.03; P$2 -0.65,3.03; P$3 0,3.03; P$4 0.65,3.03; P$5 1.3,3.03 | drill 0.8 pad 1.2: P$6 -2.425,3.03; P$7 2.425,3.03 | drill 1 pad 1.4: P$8 2.725,0; P$9 -2.725,0 | smd 1.425 x 2.5: P$10 0.963,-0.25; P$11 -0.963,-0.25

### Placement (x,y rotation side)
C1  18.29,23.37 180 top
C2  56.9,27.18 0 top
C3  36.07,16.16 90 top
C4  8.64,19.3 90 bottom
C5  3.81,31.75 90 bottom
C6  16.51,17.78 270 top
C7  19.81,30.23 270 bottom
C8  20.6,57.38 270 top
C9  14.99,57.4 90 top
C10  32.51,44.96 180 top
C11  23.88,40.64 0 bottom
C12  22.35,45.72 180 bottom
C13  22.35,47.24 0 bottom
C14  45.47,60.71 90 top
C15  53.09,51.82 180 bottom
C16  41.91,61.72 180 bottom
C17  63.75,40.64 90 top
C18  2.54,34.29 0 bottom
C19  37.34,58.93 270 top
C20  2.03,18.8 90 bottom
D1  12.7,24.89 180 top
D2  23.37,25.91 0 top
D3  38.61,35.56 90 top
F1  23.34,18.73 90 top
FB1  24.38,13.21 90 bottom
FB2  25.91,13.21 90 bottom
FB3  22.86,13.21 90 bottom
FRAME2  16.95,62.48 180 top
IC1  21.84,46.23 180 top
J1  8.73,3.8 0 top
J3  63.25,3.17 180 top
J4  33.02,3.81 0 top
J5  63.25,12.06 180 top
J6  63.25,20.95 180 top
JP1  37.59,48.77 180 top
JP2  55.37,38.61 270 top
JP3  48.26,39.37 270 top
JP4  6.35,39.37 270 top
LED1  54.61,1.27 180 top
Q1  35.05,36.58 90 top
R1  35.31,27.69 270 top
R2  36.32,13.97 180 bottom
R3  37.59,17.27 270 bottom
R4  6.6,19.3 90 bottom
R5  8.89,30.23 90 bottom
R6  32.51,42.42 180 top
R7  32.51,43.69 180 top
R8  1.27,31.4 270 bottom
R9  18.29,30.23 90 bottom
R10  18.54,14.22 270 bottom
R11  34.8,9.91 0 bottom
R12  41.15,28.96 270 top
R13  37.59,22.35 270 bottom
R14  40.39,9.91 180 bottom
R15  29.46,9.91 0 bottom
R16  45.21,9.91 0 bottom
R17  30.23,56.13 0 bottom
R18  2.54,24.13 270 top
R19  54.61,1.27 180 bottom
R20  38.61,61.72 180 bottom
R21  45.72,57.25 90 top
R22  32.51,41.15 0 top
R23  34.32,31.69 180 top
R24  4.06,18.8 90 bottom
R25  4.06,21.84 90 bottom
S1  59.69,50.8 0 top
T1  32,28.45 0 top
T2  28.45,28.45 0 top
T3  31.5,36.58 180 top
U1  30.48,19.81 90 top
U2  8.13,18.29 270 top
U3  50.8,16.51 0 top
U4  7.62,59.69 0 top
U5  56.39,30.48 180 top
U6  23.37,9.65 0 bottom
U7  13.46,30.23 180 bottom
U8  54.61,5.08 180 top
U9  17.78,57.4 270 top
U10  41.15,58.42 0 bottom
U11  59.16,53.85 0 top
U12  41.15,58.17 0 top
U13  56.9,23.37 180 top
U14  42.42,18.41 180 bottom
U15  2.54,33.02 90 top
U16  54.61,5.08 0 bottom
U17  54.61,8.89 180 top
U18  54.61,8.89 0 bottom
U$1  62.74,26.67 0 bottom
U$2  17.02,48.51 0 bottom
U$3  2.54,60.96 0 top
U$4  58.42,16.51 0 top
U$5  65.41,34.29 90 top
U$6  58.42,16.51 0 bottom
U$7  2.54,60.96 0 bottom

### Tracks (layer width: path | path; a pad name or v marks a point on that pad's centre or on a via)
3.3V  (via drill 0.25 pad 0.03)
  Top 0.203: U11.2 53.28,60.51 53.34,60.45 | 46.02,59.5 U11.3 U11.2 | v55.88,60.96 53.5,60.96 U11.2 | R21.2 45.72,59.8 C14.1 | 63.36,41.29 C17.2 63.61,41.15 | 62.48,44.75 U11.20 62.31,45.64 62.23,45.72 v62.23,51.56 | 53.85,59.44 54.61,59.44 55.12,58.93 v55.12,51.56 54.68,52 U11.9 | C19.A 40.26,60.33 v40.39,60.45 42.16,60.45 42.45,60.17 U12.5
  Top 0.254: 46.02,59.5 C14.1 | 63.36,41.29 62.48,42.16 62.48,44.75 | JP2.2 57.91,38.35 59.18,39.62 59.94,39.62 61.47,41.15 63.61,41.15
  Top 0.406: 53.85,59.44 53.16,59.44 U11.3
  Bottom 0.203: v55.88,60.96 55.29,60.37 U10.1 44.2,60.5 44.2,61.98 43.69,62.48 40.13,62.48 39.37,61.72 | C15.2 54.86,51.82 v55.12,51.56 v62.23,51.56 | 39.37,61.72 R20.2 | 39.37,61.72 39.37,61.47 v40.39,60.45
3.3V_EN  (via drill 0.25 pad 0.03)
  Top 0.203: IC1.51 17.53,38.51 17.53,40.39 18.03,40.89 18.03,41.91 18.29,42.16 18.29,42.67 18.03,42.93 v18.03,50.55 | U12.3 39.62,56.99 v39.62,55.12 | v23.88,52.58 v23.88,50.55
  Bottom 0.203: v39.62,55.12 39.37,54.86 35.05,54.86 33.53,53.34 26.67,53.34 25.91,52.58 v23.88,52.58 | v23.88,50.55 v18.03,50.55
5V  (via drill 0.25, 0.25 pad 0.03, 0.8)
  Top 0.305: U15.6 1.52,34.44 1.52,35.56 2.03,36.07 v4.06,36.07 | U13.5 v56.77,22.61 | IC1.64 27.84,39.02 v28.19,39.88 | IC1.3 28.37,41.83 v28.19,41.66 | v17.27,9.65 v17.27,13.21 | D3.C v38.61,32.77 v38.61,31.75 | IC1.21 24.64,52.33 v24.64,47.24 | IC1.52 18.24,40.09 18.8,40.64 v18.8,44.96 | v36.07,32.77 36.07,35.41 Q1.S | R23.1 36.01,31.69 v36.07,31.75 | T2.C 29.55,29.55 v29.72,29.72 29.89,29.55 T1.C | U12.1 40.04,58.93 v41.15,58.93
  Top 0.406: U1.2
  Top 0.635: U1.2 33.43,14.76
  Top 0.813: 33.43,14.76 C3.A
  Top 1.27: U1.2 32.57,15.8 v30.48,15.75
  Bottom 0.305: C5.1 4.68,31.1 5.08,31.5 5.08,35.05 v4.06,36.07 | v28.19,41.66 v28.19,39.88 | U10.14 39.03,60.37 40.01,58.93 v41.15,58.93 41.15,61.61 C16.1 | v18.54,16.76 R10.1 17.92,14.87 17.27,14.22 v17.27,13.21 | U6.5 v17.27,9.65 | v36.07,32.77 v38.61,32.77 | v36.07,31.75 v38.61,31.75 | C12.1 21.59,45.72 | v24.64,47.24 C13.1 23,47.02 C12.1 | v18.8,44.96 20.94,44.96 C12.1 | U7.8 19.68,28.32 v19.81,28.45 C7.2 | R17.1 30.99,56.25 v30.99,57.4
  pour Route15 (isolate 0.254, rank 2): 1,62.5 66.31,62.5 66.31,39.62 60.96,39.62 60.45,39.12 60.45,37.34 59.44,37.34 58.67,36.58 58.67,34.04 58.42,33.53 53.85,33.53 53.34,33.02 53.34,25.4 53.85,24.89 66.55,24.89 66.31,24.38 66.31,1 4.57,1 4.57,12.43 1,12.43
5V_USB  (via drill 0.25 pad 0.03)
  Top 0.305: U$5.P$1 55.34,32.99 54.36,32 54.36,30.48 | 54.36,30.48 U5.5 | C2.A 55.5,27.82 v54.36,28.96 54.36,30.48 | IC1.8 31.35,45.83 v31.5,45.97 | v35.05,44.7 35.81,43.94 v37.08,43.94 | v35.05,42.16 Q1.D 35.22,37.85 v36.07,37.85 | D3.A 38.61,37.08 38.35,37.34 v38.35,37.59 | v42.93,29.21 42.67,29.72 v42.67,37.59
  Bottom 0.305: v31.5,45.97 33.78,45.97 v35.05,44.7 | v37.08,43.94 37.08,42.67 36.58,42.16 v35.05,42.16 | v36.07,37.85 36.58,37.59 v38.35,37.59 v42.67,37.59 | v42.93,29.21 52.32,29.21 52.58,28.96 v54.36,28.96
12V  (via drill 0.25)
  Top 0.305: U15.3 3.49,30.41 2.54,29.46 1.4,29.46 1.14,29.08 1.14,22.73 R18.2
  Top 0.406: U2.3 7.49,19.94 7.37,19.81 5.84,19.81 4.83,20.83 4.83,23.11 5.08,23.37 v4.06,23.37
  Top 0.61: D1.C 16.51,23.01 16.51,21.59 | 16.51,21.59 16.51,20.83 C6.+ | C1.2 16.51,21.59
  Top 0.635: U2.2 8.76,20.17 v10.16,19.81 | U1.1 28.2,17.52 27.43,18.29 23.88,18.29 23.37,18.8 23.37,22.38 F1.P$2 21.47,24.28 D2.C 18.29,25.91 17.64,25.26 C1.2
  Top 0.813: U2.1 16.18,21.16 16.51,20.83
  Bottom 0.305: C4.2 8.78,19.81
  Bottom 0.406: R25.2 v4.06,23.37
  Bottom 0.635: 8.78,19.81 v10.16,19.81
  pour Top (no thermals): 1.27,20.83 4.57,20.83 6.1,19.81 10.67,19.81 11.18,20.32 11.18,22.35 10.67,22.86 6.6,22.86 5.59,23.88 1.27,23.88
12V_MOT
  Top 0.305: U15.4 4.75,34.37 5.08,34.04 5.08,28.96 JP4.11
  pour Top (no thermals): 1.78,24.64 7.62,24.64 7.62,28.96 1.78,28.96
A  (via drill 0.25, 0.25 pad 0.03)
  Top 0.254: J4.13 v44.7,2.54 | v19.81,7.11 v19.81,21.84 | v14.48,27.18 v14.48,30.73 | v28.96,2.54 J4.1 28.95,2.8 v28.96,2.54
  Bottom 0.254: v44.7,2.54 v28.96,2.54 22.1,2.54 21.08,3.56 21.08,5.84 v19.81,7.11 | R9.2 18.29,30.86 U7.6 15.94,30.73 v14.48,30.73 | v19.81,21.84 v14.48,27.18
AREF  (via drill 0.25)
  Top 0.203: IC1.62 26.16,38.35
  Top 0.254: IC1.62 26.24,39.29 v25.65,39.88
  Bottom 0.203: C11.1 25.51,39.88 v25.65,39.88
B
  Bottom 0.203: 28.96,7.87 28.7,8.13 27.94,8.13 26.92,9.14 26.92,26.42 27.43,26.92 27.43,28.45 25.65,29.97 22.1,29.97 21.84,30.23 18.8,30.23 R9.1
  Bottom 0.254: R9.1 18.29,29.59 U7.7 | J4.14 42.92,7.87 28.96,7.87 28.2,6.86 J4.2
CCO  (via drill 0.25 pad 0.03)
  Top 0.203: 56.64,5.08 U8.C v56.64,7.11
  Top 0.254: v57.91,6.35 56.64,5.08
  Bottom 0.203: U14.13 43.69,17.78 43.18,17.27 43.18,15.75 43.69,15.24 U14.15 46.23,15.24 49.28,12.19 49.28,8.64 50.8,7.11 v56.64,7.11 | U8.C 56.64,5.08 v57.91,6.35
  Bottom 0.254: J3.1 62.87,6.35 v57.91,6.35
CCO2  (via drill 0.25 pad 0.03)
  Top 0.203: v56.13,17.53 56.13,8.89 56.59,8.84 U17.C 58.17,8.89 v58.42,8.64
  Bottom 0.203: U14.9 44.2,22.86 43.18,21.84 43.18,20.83 43.69,20.32 U14.11 46.48,20.32 47.24,21.08 52.83,21.08 56.13,17.78 v56.13,17.53 | J5.1 62.61,8.64 v58.42,8.64 58.17,8.89 U17.C
CFO  (via drill 0.25 pad 0.03)
  Top 0.203: v46.74,16.26 46.74,14.73 51.31,10.16 v51.31,5.59
  Bottom 0.203: U14.14 46.48,16.51 v46.74,16.26 | v51.31,5.59 51.82,5.08 U16.A
  Bottom 0.254: J3.4 58.04,3.17 57.91,3.05 53.34,3.05 52.62,3.76 U16.A
CFO2  (via drill 0.25 pad 0.03)
  Top 0.203: v56.9,18.03 v56.9,12.7
  Bottom 0.203: U14.10 53.09,21.59 56.64,18.03 v56.9,18.03 | v56.9,12.7 58.51,12.7 J5.4
  Bottom 0.254: J5.4 55.8,12.06 U18.A
COM1  (via drill 0.25 pad 0.03)
  Top 0.203: v17.27,26.92 15.75,28.45 15.75,36.32 16,36.58 16,38.27 IC1.49
  Top 0.254: v23.88,24.38 23.37,25.4 v23.37,27.43
  Bottom 0.254: FB1.2 24.38,16.76 23.88,17.27 v23.88,24.38 | v17.27,26.92 20.32,26.92 20.83,27.43 v23.37,27.43
COM1_P  (via drill 0.25 pad 0.03)
  Top 0.203: J4.3 26.92,7.11 25.4,8.64 v25.4,10.67
  Bottom 0.203: U6.1 24.63,10.67 v25.4,10.67
  Bottom 0.254: J4.3 26.92,4.32 27.18,4.06 41.65,4.06 J4.15 | U6.1 24.38,10.79 FB1.1
COM2  (via drill 0.25 pad 0.03)
  Top 0.203: v24.89,24.38 24.13,25.15 24.13,26.92 v24.64,27.43
  Top 0.254: IC1.18 27.04,52.95 26.42,52.32 v26.42,40.89 | v26.42,36.83 v26.42,27.43
  Bottom 0.254: FB2.2 25.91,16.76 24.89,17.78 v24.89,24.38 | v26.42,40.89 v26.42,36.83 | v26.42,27.43 v24.64,27.43
COM2_P  (via drill 0.25 pad 0.03)
  Top 0.254: J4.4 v25.91,1.91 | v41.66,1.78 v41.65,1.78 J4.16
  Bottom 0.254: J4.4 24.57,8.19 U6.3 25.47,8.7 25.91,9.14 25.91,10.16 26.16,10.41 26.16,10.92 25.91,11.18 FB2.1 | v25.91,1.91 26.8,1.91 26.92,1.78 v41.66,1.78
COM3  (via drill 0.25 pad 0.03)
  Top 0.254: v22.35,17.27 v22.35,20.32 | v22.86,24.38 22.86,26.92 22.35,27.43 v22.35,30.73 | IC1.1 29.64,30.79 v29.46,30.61
  Bottom 0.254: FB3.2 22.86,16.76 v22.35,17.27 | v22.35,20.32 22.35,23.88 v22.86,24.38 | v29.46,30.61 28.96,30.61 28.7,30.73 25.91,30.73 25.65,30.48 25.15,30.48 24.89,30.73 v22.35,30.73
COM3_P  (via drill 0.25)
  Top 0.254: J4.20 v37.59,3.3 | v21.84,3.81 J4.8
  Bottom 0.254: v37.59,3.3 22.35,3.3 v21.84,3.81 | J4.8 22.17,7.19 U6.4 23.07,8.7 23.07,11.59 FB3.1
CST  (via drill 0.25 pad 0.03)
  Top 0.203: v51.31,4.32 52.32,4.32 52.32,4.87 U8.A | v46.74,5.59 v46.74,13.46
  Top 0.254: J3.3 J3.2 v58.37,5.03 | U8.A 53.59,5.08 53.9,4.78 v53.9,4.57
  Bottom 0.203: v46.74,5.59 46.99,5.59 48.9,4.32 v51.31,4.32
  Bottom 0.254: v53.9,4.57 53.9,4.02 54.36,3.56 57.4,3.56 58.37,4.52 v58.37,5.03 | U14.16 46.23,13.97 v46.74,13.46
CST2  (via drill 0.25 pad 0.03)
  Top 0.203: v55.37,16.76 v55.37,13.72 | U17.A 52.58,8.94 52.58,12.19 53.85,13.46 v53.85,13.72
  Top 0.254: J5.2 J5.3
  Bottom 0.203: U14.12 46.48,19.05 47.75,20.32 52.83,20.32 55.37,17.78 v55.37,16.76 | J5.2 60.94,13.72 v55.37,13.72 v53.85,13.72
D_N  (via drill 0.25)
  Top 0.203: v63.88,33.53 63.64,33.64 U$5.P$2 61.18,33.64 60.96,33.86 54.94,33.86 53.52,32.44 53.52,22.28 51.64,20.4 40.82,20.4 39.7,21.52 39.7,37.26 38.43,38.53 38.43,42.6 38.03,43 34.04,43 33.45,42.42 R6.1 | U5.1 59.12,29.53 v59.69,29.97
  Bottom 0.203: v59.69,29.97 59.87,29.97 60.2,30.3 60.53,30.3 61.14,30.91 61.14,33.45 61.54,33.86 63.42,33.86 v63.88,33.53
D_P  (via drill 0.25)
  Top 0.203: v63.88,34.54 63.5,34.29 U$5.P$3 61.04,34.29 60.96,34.21 54.79,34.21 53.16,32.59 53.16,22.43 51.49,20.75 40.97,20.75 40.06,21.66 40.06,37.41 38.79,38.68 38.79,42.75 38.17,43.36 34.04,43.36 33.71,43.69 R7.1 | U5.3 58.86,31.43 v58.93,31.5
  Bottom 0.203: v58.93,31.5 59.11,31.5 59.94,30.66 60.38,30.66 60.78,31.06 60.78,33.6 61.39,34.21 63.42,34.21 v63.88,34.54
DE  (via drill 0.25 pad 0.03)
  Top 0.203: IC1.29 18.29,53.98 v18.29,52.58 | v10.41,53.34 v10.41,36.83 | v12.19,36.83 12.19,30.73 v12.95,29.97
  Bottom 0.203: v18.29,52.58 17.27,53.34 v10.41,53.34 | v10.41,36.83 v12.19,36.83 | v12.95,29.97 12.57,29.59 U7.2
  Bottom 0.254: U7.3 U7.2 8.9,29.59 R5.1
E-STOP  (via drill 0.25)
  Top 0.203: v25.4,31.24 25.4,38.38 IC1.61 25.44,39.07 24.89,39.62 24.89,40.13 25.65,40.89 25.65,52.32 26.16,52.83 IC1.19
  Bottom 0.203: JP3.10 47.5,30.99 30.23,30.99 29.97,31.24 v25.4,31.24
FOC  (via drill 0.25, 0.25 pad 0.03)
  Top 0.203: v36.58,19.3 36.58,24.89 37.08,25.91 37.08,41.66 v37.59,42.16 | v42.93,42.16 v42.93,50.04 | v35.31,51.82 33.27,49.78 29.69,49.78 IC1.13
  Bottom 0.203: R3.1 37.59,18.8 37.08,19.3 v36.58,19.3 | v37.59,42.16 v42.93,42.16 | v35.31,51.82 39.62,51.82 40.13,51.31 JP1.1 v42.93,50.04
FOC2  (via drill 0.25, 0.25 pad 0.03)
  Top 0.203: v30.98,49.03 IC1.12 | v37.59,24.89 37.59,40.89 v37.85,41.15 | v40.89,41.15 40.64,41.4 40.64,44.7 41.66,45.72 41.66,48.26 41.15,48.77 38.86,48.77 JP1.4
  Bottom 0.203: v30.98,49.03 31.24,48.77 36.32,48.77 JP1.4 | R13.1 v37.59,24.89 | v37.85,41.15 v40.89,41.15
GND  (via drill 0.25, 0.25 pad 0.03, 0.6, 0.7, 0.8)
  Top 0.305: C2.C v57.02,27.18 | 63.75,45.08 U11.21 63.56,42.87 v63.75,42.67 64.52,42.67 65.02,42.16 65.02,40.64 64.37,39.99 C17.1 | U$5.P$5 62.22,35.56 v60.45,35.56 | U5.2 v58.93,30.48 | U13.2 57.4,23.37 v56.9,23.88 | IC1.6 28.92,44.23 v28.32,44.7 | C10.1 33.78,44.96 v34.04,44.7 | IC1.63 27.18,38.56 v27.18,39.88 | IC1.53 v19.04,37.09 v19.05,37.08 | LED1.C 56.63,2.41 v57.4,2.41 | v55.88,61.98 53.31,61.98 U11.1 46.11,62 C14.2 | U15.2 v2.54,33.02 | U11.30 62.84,57 v62.74,56.9 | T3.E 30.55,39.05 v30.48,39.12 | JP2.1 v59.43,40.64 v59.44,40.64 | U11.10 54.92,50.75 v55.37,50.29 | v35.56,57.91 35.94,57.53 C19.C 37.34,57.66 37.59,57.91 39.59,57.91 U12.2
  Top 0.61: C1.1 19.56,23.99 v19.56,24.64
  Top 0.635: U1.4 27.17,25.91 D2.A
  Top 0.813: C3.C 35.27,17.56 34.54,18.29 v31.75,18.29 | C6.- 16.51,14.73 v14.48,12.7
  Bottom 0.305: R4.1 6.75,18.65 | R5.2 8.89,32.26 9.65,33.02 15.75,33.02 16,32.77 16,32.19 U7.5 | U10.7 44.07,55.5 v44.2,55.37
  other vias: 29.97,18.29 18.8,59.94 59.94,32 60.45,28.32 58.93,62.23 58.93,60.96 58.93,59.69 58.93,58.17 58.93,56.9 60.2,56.9 61.47,56.9 15.75,55.37 15.75,59.94 21.84,59.94 23.37,58.93 21.84,56.9 23.62,55.37 20.83,30.86
  pour Route2: 1,62.5 66.31,62.5 66.31,1 4.57,1 4.57,12.43 1,12.43
  pour Top (no thermals): 29.21,17.53 32.26,17.53 32.26,19.81 29.21,19.81
  pour Top: 13.72,60.45 13.72,54.86 23.62,54.86 23.62,54.36 24.13,54.36 24.13,60.45
  pour Route15: 54.36,33.02 53.85,32.51 53.85,25.91 54.36,25.4 54.86,25.4 67.06,25.4 67.06,38.61 66.55,39.12 61.47,39.12 60.96,38.61 60.96,37.08 60.45,36.58 59.94,36.58 59.44,36.07 59.44,33.53 58.93,33.02
  pour Bottom (isolate 0.254, rank 2): 1,62.5 66.31,62.5 66.31,1 4.57,1 4.57,12.43 1,12.43
N$1  (via drill 0.25 pad 0.03)
  Top 0.203: v34.8,61.72 v34.8,56.39
  Bottom 0.203: R20.1 v34.8,61.72 | v34.8,56.39 38.15,56.39 arc90 U10.8
N$2
  Top 0.203: R22.2 33.16,38.39 T3.B
N$3  (via drill 0.25 pad 0.03)
  Top 0.254: v52.32,2.03 53.09,1.27 LED1.A
  Bottom 0.254: R19.1 53.2,2.03 v52.32,2.03
N$4
  Bottom 0.203: R15.1 30.11,11.54 J4.10
N$5  (via drill 0.25)
  Top 0.254: U2.4 v6.22,22.86 | v9.65,23.62 10.8,24.77
  Top 0.406: 10.8,24.77 D1.A
  Bottom 0.254: v9.65,23.62 6.99,23.62 v6.22,22.86 6.22,20.72 R4.2
N$6
  Bottom 0.203: U14.1 R2.2
N$7
  Bottom 0.203: U14.3 39.71,16.62 R3.2
N$8  (via drill 0.25)
  Top 0.203: U15.1 1.59,31.43 v2.29,30.23
  Bottom 0.203: v2.29,30.23 2.03,30.48 1.54,30.48 R8.2
N$9  (via drill 0.25 pad 0.03)
  Top 0.203: v41.66,12.05 v41.66,18.8
  Bottom 0.203: R14.2 41.66,11.18 v41.66,12.05 | v41.66,18.8 41.4,19.05 U14.5
N$10
  Bottom 0.203: U14.7 39.71,21.7 R13.2
N$11
  Bottom 0.203: R10.2
  Bottom 0.254: R10.2 J4.12
N$12
  Bottom 0.203: J4.24 34.15,11.54 R11.2
N$13  (via drill 0.25 pad 0.03)
  Top 0.203: 34.1,33.34 v33.78,32.77 33.67,32.66
  Top 0.305: Q1.G 34.1,33.34 | v31.5,32.77 T3.C | R23.2 33.67,32.66
  Bottom 0.305: v33.78,32.77 v31.5,32.77
N$14
  Bottom 0.203: R16.1 45.86,11.54 J4.22
N$15  (via drill 0.25, 0.25 pad 0.03)
  Top 0.635: v38.61,1.02 J4.19 39.62,6.09 J4.18 | v22.86,1.02 J4.7 22.86,5.85 J4.6 23.34,7.39 F1.P$1
  Bottom 0.61: v38.61,1.02
  Bottom 0.635: v38.61,1.02 v22.86,1.02
N$16
  pour Bottom: 56,1 67,1 67,6 55,6 55,1
N$17
  Top 0.203: T1.B 31.05,27.5 32,28.45 34.04,28.45 34.04,27.43 34.54,26.92 35.19,26.92 R1.2
N$67  (via drill 0.25 pad 0.03)
  Top 0.203: T2.B 28.68,26.16 31.24,26.16 31.37,26.29 v32,26.29 | v41.15,26.16 R12.2
  Bottom 0.203: v32,26.29 32.77,26.29 32.89,26.16 v41.15,26.16
OK_SHT  (via drill 0.25 pad 0.03)
  Top 0.203: v34.04,25.4 34.04,25.76 T1.E
  Bottom 0.203: R15.2 28.81,12.05 29.97,13.21 34.91,13.21 R2.1 35.56,14.08 35.56,19.56 34.04,21.08 v34.04,25.4
OK_SHT2  (via drill 0.25 pad 0.03)
  Top 0.203: T2.E 29.46,27.28 v30.23,28.45
  Bottom 0.203: R14.1 R11.1 35.45,9.54 34.54,8.64 28.19,8.64 27.69,9.14 27.69,12.45 28.45,13.21 28.45,18.29 30.23,20.07 v30.23,28.45
P0_0  (via drill 0.25 pad 0.03)
  Top 0.203: U11.28 63.36,54.5 v62.99,54.86 | v60.45,54.86 60.45,47.75 v61.21,46.99 | v66.04,45.72 v66.04,39.12 | v59.44,38.61 v59.44,35.81 | v50.8,32.51 50.55,32 v50.55,22.35 | v54.36,22.35 54.36,17.78 54.61,17.27 54.61,12.95 54.86,12.7 v54.86,2.29
  Bottom 0.203: v62.99,54.86 v60.45,54.86 | v61.21,46.99 62.48,45.72 v66.04,45.72 | v66.04,39.12 65.53,38.61 v59.44,38.61 | v59.44,35.81 59.44,33.02 58.67,32.26 55.37,32.26 55.12,32 51.31,32 v50.8,32.51 | v50.55,22.35 v54.36,22.35 | v54.86,2.29 55.37,2.03 55.37,1.38 R19.2
P0_1/INT  (via drill 0.25 pad 0.03)
  Top 0.203: U11.27 63.59,53.25 v62.99,53.85 | v56.64,53.85 56.64,54.1 56.39,54.36 56.39,56.9 56.64,57.4 v56.64,57.78
  Bottom 0.203: U10.4 56.01,58.42 v56.64,57.78 | v62.99,53.85 v56.64,53.85
P0_4/TX  (via drill 0.25 pad 0.03)
  Top 0.203: v57.4,59.44 57.91,58.93 57.91,57.4 57.4,56.39 57.4,54.86 57.91,54.36 57.91,53.34 56.9,52.32 56.9,51.56 57.15,51.31 57.15,50.55 v57.4,50.29 | v62.99,50.29 63.75,49.53 65.3,49.53 U11.24
  Bottom 0.203: v57.4,50.29 v62.99,50.29 | U10.2 57.12,59.72 v57.4,59.44
P0_5/RX  (via drill 0.25 pad 0.03)
  Top 0.203: U11.23 63.49,48.25 v62.99,47.75 | v56.9,58.67 57.4,58.17 57.4,57.4 56.9,56.64 56.9,54.61 57.4,54.1 57.4,53.59 56.39,52.58 56.39,51.31 56.64,51.05 v56.64,47.75
  Bottom 0.203: v56.64,47.75 v62.99,47.75 | U10.3 44.18,59.18 56.13,59.18 56.64,58.67 v56.9,58.67
P1_0  (via drill 0.25 pad 0.03)
  Top 0.203: v55.88,57.4 55.88,51.05 56.13,50.8 56.13,49.78 55.88,49.53 v55.88,46.99 | v59.94,46.99 59.93,46.73 U11.18
  Bottom 0.203: 44.21,57.91 55.37,57.91 v55.88,57.4 | v55.88,46.99 v59.94,46.99
  Bottom 0.254: U10.5 44.21,57.91
P1_0_5V  (via drill 0.25 pad 0.03)
  Top 0.203: IC1.50 16.64,40.27 17.27,40.89 17.27,42.16 v17.53,42.42 | v23.88,42.42 v23.88,49.28 | v28.32,49.28 28.45,49.78 28.45,53.09 v29.72,54.36 | v32.26,54.36 v32.26,58.67
  Bottom 0.203: U10.10 38.12,57.66 37.08,57.66 35.56,59.18 33.78,59.18 33.27,58.67 v32.26,58.67 | v17.53,42.42 v23.88,42.42 | v23.88,49.28 v28.32,49.28 | v29.72,54.36 v32.26,54.36
P2_1  (via drill 0.25 pad 0.03)
  Top 0.203: U11.5 51.41,57 51.31,56.9 51.31,43.43 51.56,43.18 v51.56,38.61 | v56.64,38.61 JP2.4
  Bottom 0.203: v51.56,38.61 v56.64,38.61
P2_2  (via drill 0.25 pad 0.03)
  Top 0.203: U11.4 51.14,58.25 50.8,57.91 v50.8,42.67 | v56.64,42.67 JP2.3
  Bottom 0.203: v50.8,42.67 v56.64,42.67
PB4  (via drill 0.25 pad 0.03)
  Top 0.203: v42.42,9.91 42.42,12.7 42.16,12.95 42.16,18.03 42.42,18.29 42.42,19.05 42.16,19.3 v42.16,19.56 | v42.16,21.59 42.16,32.26 41.66,32.77 41.66,44.7 42.16,45.21 v42.16,53.85 | IC1.14 29.73,50.55 32.77,50.55 v35.81,53.59
  Bottom 0.203: R16.2 44.56,9.79 44.45,9.91 v42.42,9.91 | v42.16,19.56 v42.16,21.59 | v42.16,53.85 36.07,53.85 v35.81,53.59
PB7  (via drill 0.25 pad 0.03)
  Top 0.203: IC1.17 27.94,53.85 27.94,50.04 27.69,49.78 27.69,49.02 27.94,48.77 27.94,45.34 27.69,45.09 27.69,44.32 27.84,44.16 v27.84,43.02
  Bottom 0.203: v27.84,43.02 30.73,40.13 42.67,40.13 JP3.4
PC0  (via drill 0.25 pad 0.03)
  Top 0.203: IC1.35 11.86,50.63 v11.68,50.8
  Bottom 0.203: v11.68,50.8 8.13,50.8 8.13,51.56 JP4.1
PC1  (via drill 0.25 pad 0.03)
  Top 0.203: IC1.36 13.76,49.83 13.72,49.78 v12.7,49.78
  Bottom 0.203: v12.7,49.78 7.37,49.78 JP4.2
PC2  (via drill 0.25)
  Top 0.203: IC1.37 11.94,49.03 v11.68,49.02
  Bottom 0.203: JP4.3 7.11,49.02 v11.68,49.02
PC3  (via drill 0.25 pad 0.03)
  Top 0.203: IC1.38 12.73,48.23 v12.7,48.26 | v8.13,48.26 v8.13,45.72
  Bottom 0.203: v12.7,48.26 v8.13,48.26 | v8.13,45.72 JP4.4
PC4  (via drill 0.25, 0.25 pad 0.03)
  Top 0.203: IC1.39 14.29,47.43 13.21,47.24 v11.68,47.24 | v9.65,43.18 9.65,43.43 8.89,44.2 v8.89,47.24
  Bottom 0.203: JP4.5 v9.65,43.18 | v8.89,47.24 v11.68,47.24
PC5  (via drill 0.25)
  Top 0.203: IC1.40 12.59,46.63 12.19,46.23 v12.19,40.64
  Bottom 0.203: JP4.6 v12.19,40.64
PD0  (via drill 0.25, 0.25 pad 0.03)
  Top 0.203: IC1.25 21.44,53.49 21.84,53.09 v21.84,39.75 | v21.84,37.08 21.84,34.04 v22.61,33.27 | v45.72,23.88 v45.72,32.51 | v54.86,23.88 55.31,24.32 U13.4 56.52,25.15 58.42,25.15 58.89,24.68 J6.4
  Bottom 0.203: v21.84,39.75 v21.84,37.08 | v45.72,23.88 45.97,23.62 46.48,23.62 46.74,23.37 49.78,23.37 50.29,23.88 v54.86,23.88 | v45.72,32.51 44.7,33.53 22.86,33.53 v22.61,33.27
PD1  (via drill 0.25, 0.25 pad 0.03)
  Top 0.203: IC1.26 20.64,53.52 21.08,53.09 21.08,51.82 20.32,51.05 20.32,47.24 20.83,46.74 20.83,46.23 20.57,45.97 v20.57,41.15 | v17.27,37.08 17.78,36.58 v17.78,32.51 | v32.51,32 32.51,31.5 33.53,30.48 v33.53,30.23 | v46.48,30.23 v46.48,24.38 | U13.6 55.7,21.66 v55.63,21.59 55.63,21.08 56.9,19.81 60.18,19.81 J6.3 J6.2
  Bottom 0.203: v46.48,24.38 46.74,24.38 47.24,23.88 49.28,23.88 49.78,24.38 54.36,24.38 54.61,24.64 55.12,24.64 55.63,24.13 v55.63,21.59 | v20.57,41.15 18.29,41.15 17.27,40.13 v17.27,37.08 | v17.78,32.51 18.29,32 v32.51,32 | v33.53,30.23 v46.48,30.23
PD5  (via drill 0.25)
  Top 0.203: IC1.30 17.44,52.91 17.02,52.07 17.02,50.8 17.27,50.29 17.27,43.18 16.76,42.67 16.76,41.15 16,40.39 v16,39.75
  Bottom 0.203: JP4.7 15.49,38.1 16,38.61 v16,39.75
PD6  (via drill 0.25)
  Top 0.203: IC1.31 16.64,52.7 16.51,52.32 16.51,50.55 16.76,50.04 16.76,43.43 16.26,42.93 16.26,41.4 15.24,40.39 v15.24,37.08
  Bottom 0.203: JP4.8 6.6,35.56 8.64,37.59 14.73,37.59 v15.24,37.08
PD7  (via drill 0.25)
  Top 0.203: IC1.32 15.75,53.93 16,52.83 16,50.29 16.26,49.78 16.26,43.69 15.49,42.93 v15.49,41.66 | v8.13,38.86 8.13,34.04 7.11,33.02 JP4.9
  Bottom 0.203: v15.49,41.66 15.24,41.15 15.24,39.37 14.73,38.86 v8.13,38.86
PE0  (via drill 0.25 pad 0.03)
  Top 0.203: IC1.33 14.14,52.32 v15.37,52.32
  Bottom 0.203: v15.37,52.32 15.75,51.82 25.91,51.82 26.92,52.83 34.04,52.83 35.56,54.36 41.66,54.36 41.91,54.61 42.42,54.61 42.67,54.36 46.74,54.36 47.75,53.34 JP3.1
PE1  (via drill 0.25 pad 0.03)
  Top 0.203: IC1.34 14.16,51.31 v15.37,51.31
  Bottom 0.203: v15.37,51.31 26.67,51.31 26.92,51.05 27.43,51.05 27.69,51.31 31.5,51.31 31.75,51.05 33.27,51.05 34.8,52.58 46.74,52.58 JP3.2
PE2  (via drill 0.25, 0.25 pad 0.03)
  Top 0.203: IC1.43 14.01,44.2 v15.49,44.2 | v46.23,44.7 46.23,47.24 47.24,48.26 JP3.3
  Bottom 0.203: v15.49,44.2 27.94,44.2 28.19,43.94 35.31,43.94 36.07,44.7 38.86,44.7 39.12,44.45 39.62,44.45 39.88,44.7 v46.23,44.7
PE3  (via drill 0.25 pad 0.03)
  Top 0.203: IC1.9 29.79,46.48 30.73,46.48 v30.99,46.74 | v39.37,45.34 39.62,45.09 39.62,38.86 40.64,37.85 v40.64,31.75 | U5.4 55.81,31.43 v56.39,30.99 | U$5.P$4 58.82,34.94 v58.67,34.8 | v51.82,33.27 v51.82,31.24
  Bottom 0.203: v30.99,46.74 33.78,46.74 35.31,45.34 v39.37,45.34 | v40.64,31.75 50.8,31.75 51.31,31.24 v51.82,31.24 56.13,31.24 v56.39,30.99 | v58.67,34.8 52.07,34.8 51.82,34.54 v51.82,33.27
PE7  (via drill 0.25 pad 0.03)
  Top 0.203: R22.1 31.74,41.03 IC1.2 29.51,40.89 v27.43,40.89 27.18,41.15 v27.18,51.82 | v33.02,59.44 v33.02,51.82
  Bottom 0.203: U10.11 37.08,58.42 35.81,59.69 33.27,59.69 v33.02,59.44 | v33.02,51.82 v27.18,51.82
PF1  (via drill 0.25 pad 0.03)
  Top 0.203: v2.03,37.08 v2.03,39.37 | v12.95,39.62 v12.95,43.43 | IC1.60 24.64,38.86 24.38,39.37 24.38,40.64 24.64,40.89 v24.64,43.43
  Bottom 0.203: R8.1 1.27,33.02 1.89,33.64 C18.2 1.89,36.94 v2.03,37.08 | v2.03,39.37 7.37,39.37 7.62,39.62 v12.95,39.62 | v24.64,43.43 v12.95,43.43
PF2  (via drill 0.25)
  Top 0.203: IC1.59 23.88,38.4 23.88,36.83 24.13,36.58 24.13,36.07 23.88,35.81 23.88,33.02 v23.62,32.77
  Bottom 0.203: v23.62,32.77 23.37,32.51 18.8,32.51 17.53,33.78 9.4,33.78 7.62,32 7.62,29.72 7.11,29.21 4.83,29.21 2.54,26.92 2.54,21.59 3.05,21.08 3.95,21.08
  Bottom 0.254: C20.2 R24.2 R25.1 3.95,21.08
PF3  (via drill 0.25)
  Top 0.203: IC1.58 23.11,38.36 23.11,36.58 v23.37,36.32
  Bottom 0.203: JP3.5 46.74,43.18 46.74,40.13 42.67,36.07 23.62,36.07 v23.37,36.32
PF4  (via drill 0.25)
  Top 0.203: IC1.57 22.35,38.32 22.35,37.59 22.61,37.34 v22.61,35.81
  Bottom 0.203: JP3.6 43.18,35.56 22.86,35.56 v22.61,35.81
PF5  (via drill 0.25, 0.25 pad 0.03)
  Top 0.203: IC1.56 21.34,38.32 21.34,37.59 21.08,37.34 v21.08,35.31 | JP3.7 46.74,38.1 46.23,37.59 v46.23,35.31
  Bottom 0.203: v46.23,35.31 45.97,35.05 21.34,35.05 v21.08,35.31
PF6  (via drill 0.25)
  Top 0.203: IC1.55 20.57,38.36 20.57,36.83 19.56,35.81 v19.56,34.29
  Bottom 0.254: v19.56,34.29 19.81,34.54 47.24,34.54 JP3.8
PF7  (via drill 0.25)
  Top 0.203: IC1.54 19.81,38.4 19.81,36.83 18.8,35.81 v18.8,33.53
  Bottom 0.203: JP3.9 47.24,34.04 20.32,34.04 19.81,33.53 v18.8,33.53
RESET_BLE  (via drill 0.25, 0.25 pad 0.03)
  Top 0.203: U11.29 63.12,55.75 v62.99,55.88
  Top 0.254: JP2.7 54.1,42.42 53.59,42.93 v53.59,43.43 | v50.04,43.43 v50.04,52.83 50.04,56.13 49.53,56.64 v46.99,56.64 R21.1
  Bottom 0.203: S1.1 54.86,52.83 v50.04,52.83 | v62.99,55.88 47.75,55.88 v46.99,56.64
  Bottom 0.254: v50.04,43.43 v53.59,43.43
RST  (via drill 0.25 pad 0.03)
  Top 0.203: v25.4,55.37 25.44,53.8 IC1.20 | JP1.5 37.08,52.07 v37.08,55.63
  Bottom 0.203: v37.08,55.63 36.83,55.37 28.81,55.37 | 28.81,55.37 v25.4,55.37 | R17.2 28.81,55.37
RX_5V  (via drill 0.25 pad 0.03)
  Top 0.203: IC1.41 15.39,45.83 v15.49,45.72 | v20.07,46.48 19.81,46.74 19.81,51.31 20.32,51.82 v20.32,52.7 | v27.43,56.13 v27.43,59.94
  Bottom 0.203: v15.49,45.72 19.56,45.72 v20.07,46.48 | v20.32,52.7 20.32,55.63 20.83,56.13 v27.43,56.13 | v27.43,59.94 27.69,60.2 36.07,60.2 37.34,58.93 38.09,58.93 U10.12
RXA  (via drill 0.25 pad 0.03)
  Top 0.203: IC1.27 19.84,53.31 19.56,52.83 19.56,51.82 19.3,51.56 19.3,46.23 20.07,45.47 20.07,44.45 19.81,44.2 19.81,40.26 v20.32,39.75 | v13.72,34.54 v13.72,28.45
  Bottom 0.203: v20.32,39.75 20.32,36.07 18.8,34.54 v13.72,34.54 | v13.72,28.45 10.99,28.45 U7.1
SHT  (via drill 0.25 pad 0.03)
  Top 0.203: IC1.11 arc-90 29.68,48.26 33.02,48.26 33.53,48.77 36.32,48.77 JP1.3 40.13,51.82 v41.15,51.82 | R1.1 35.42,28.45 v36.32,28.45 | v44.2,28.45 v44.2,51.82
  Bottom 0.203: v36.32,28.45 v44.2,28.45 | v44.2,51.82 v41.15,51.82
SHT2
  Top 0.203: IC1.10 29.71,47.5 32.51,47.5 34.29,45.97 39.88,45.97 40.13,45.72 40.13,39.12 41.15,38.1 41.15,32.26 41.4,32 41.4,31.5 41.15,31.24 R12.1
TX_5V  (via drill 0.25 pad 0.03)
  Top 0.203: v12.19,60.71 12.19,57.91 9.65,55.37 v9.65,44.96 | v12.95,44.96 13.97,44.96 IC1.42
  Bottom 0.203: U10.13 37.31,59.72 36.32,60.71 v12.19,60.71 | v9.65,44.96 v12.95,44.96
TXA  (via drill 0.25 pad 0.03)
  Top 0.203: IC1.28 19.04,52.06 18.8,51.82 18.8,45.97 19.56,45.21 19.56,44.7 19.3,44.45 19.3,40.13 19.05,39.88 v19.05,39.75 | v12.95,35.56 v12.95,31.62
  Bottom 0.203: v19.05,39.75 19.05,39.37 19.81,38.61 19.81,36.58 18.29,35.05 14.22,35.05 13.72,35.56 v12.95,35.56 | v12.95,31.62 12.45,32 10.99,32 U7.4
UCAP
  Top 0.254: C10.2 31.79,45.03 IC1.7
USB_N
  Top 0.203: R6.2 31.65,42.63 IC1.4
USB_P
  Top 0.203: R7.2 31.6,43.43 IC1.5
VIN
  pour Top (no thermals): 5.33,16.26 5.33,8.64 10.16,8.64 11.18,10.16 11.18,16.26
XTAL1
  Top 0.203: C9.1 16.36,56.75 U9.3
  Top 0.254: U9.3 16.98,56.13 17.78,55.63 21.84,55.63 22.1,55.37 22.1,54.17 IC1.24
XTAL2
  Top 0.203: U9.1 19.65,58.33 19.81,58.17 20.47,58.17 C8.1 20.72,57.91 22.35,57.91 22.86,57.4 22.86,54.21 IC1.23

### Text on the board
tPlace: - Rev 5
tNames: PC0 | PE0 | PC1 | PE1 | PC2 | PE2 | PB7 | PC3 | PC4 | PF3 | PC5 | PF4 | PD5 | PF5 | PF6 | PD6 | PF7 | PD7 | GND | PF0/PE5 | 12V | 5V | 12V | GND